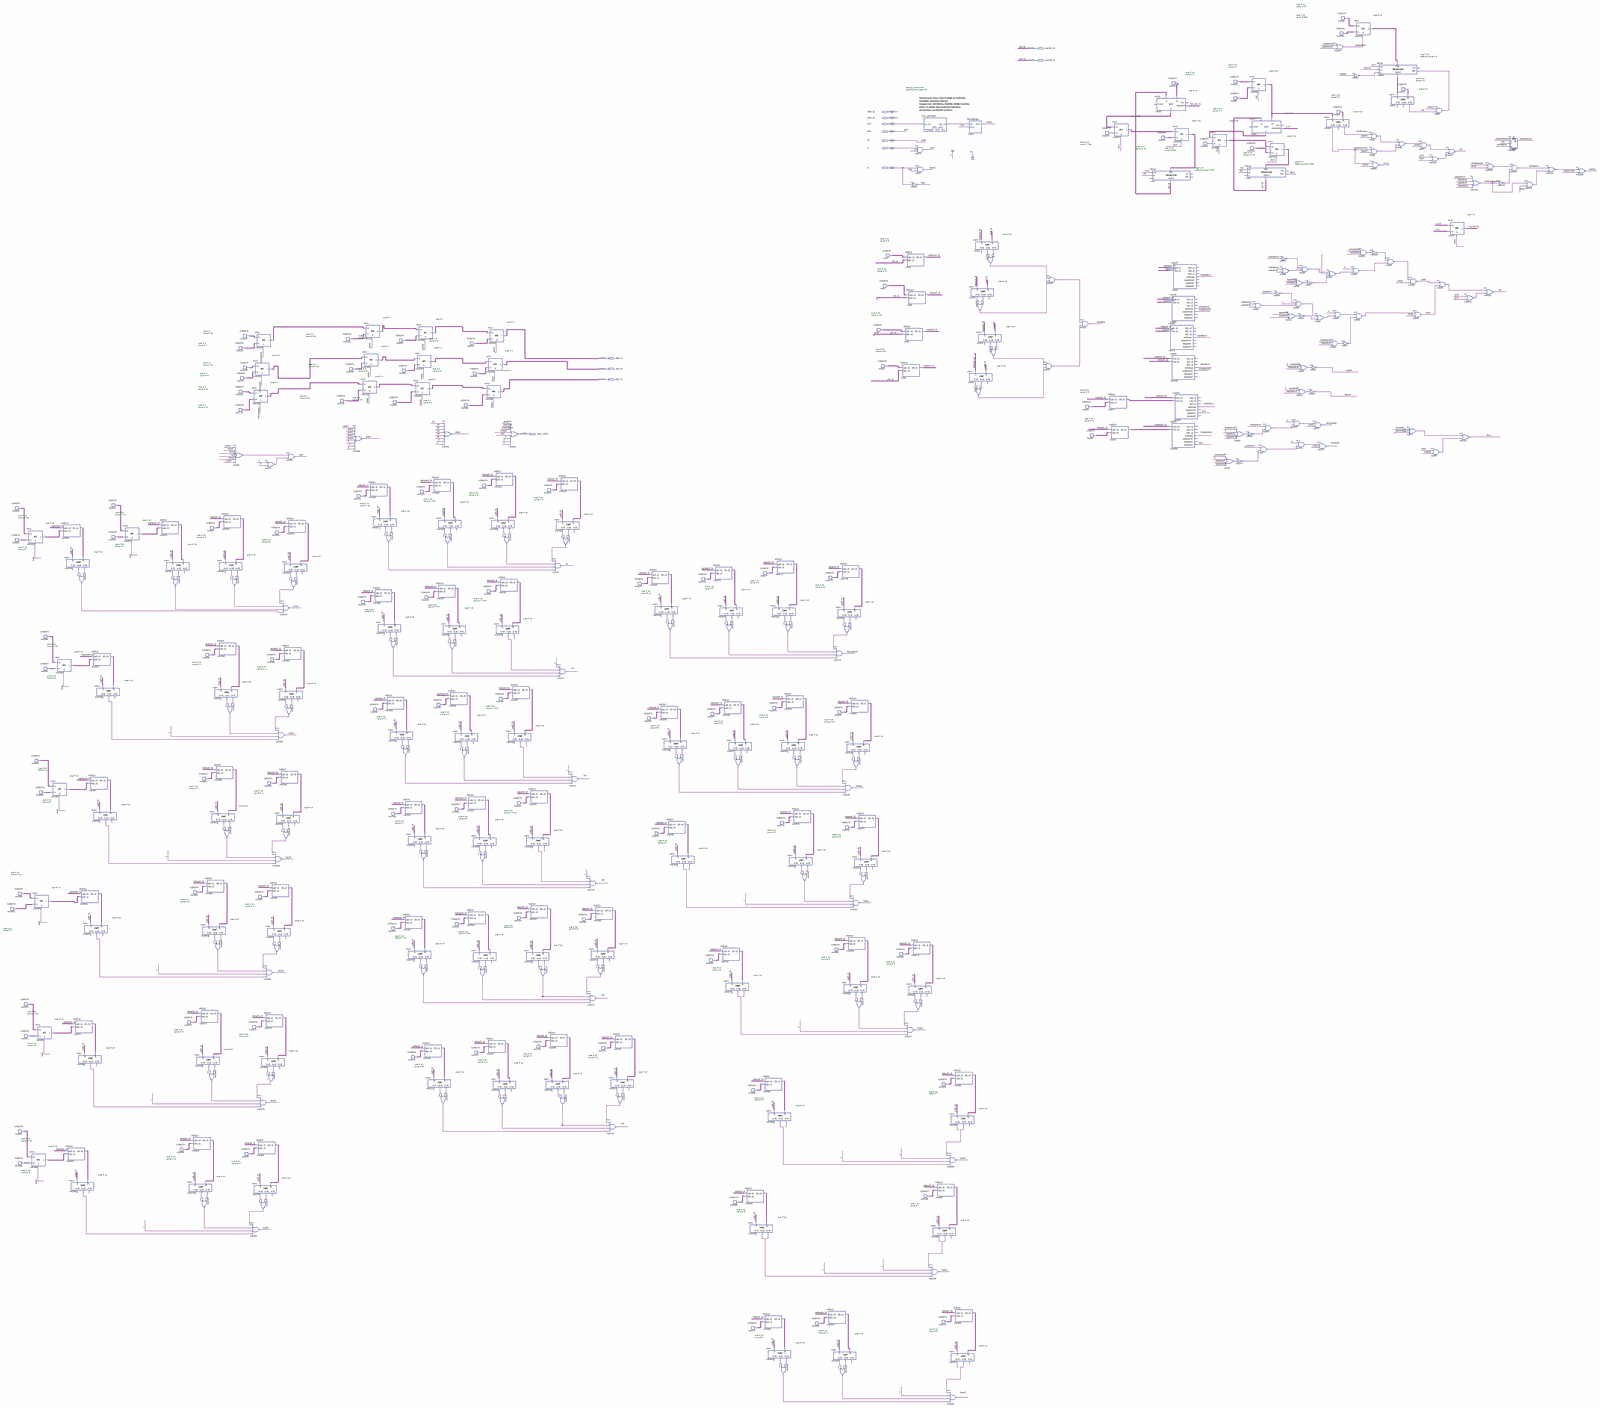
[diagram p0: schematic sheet, whole]
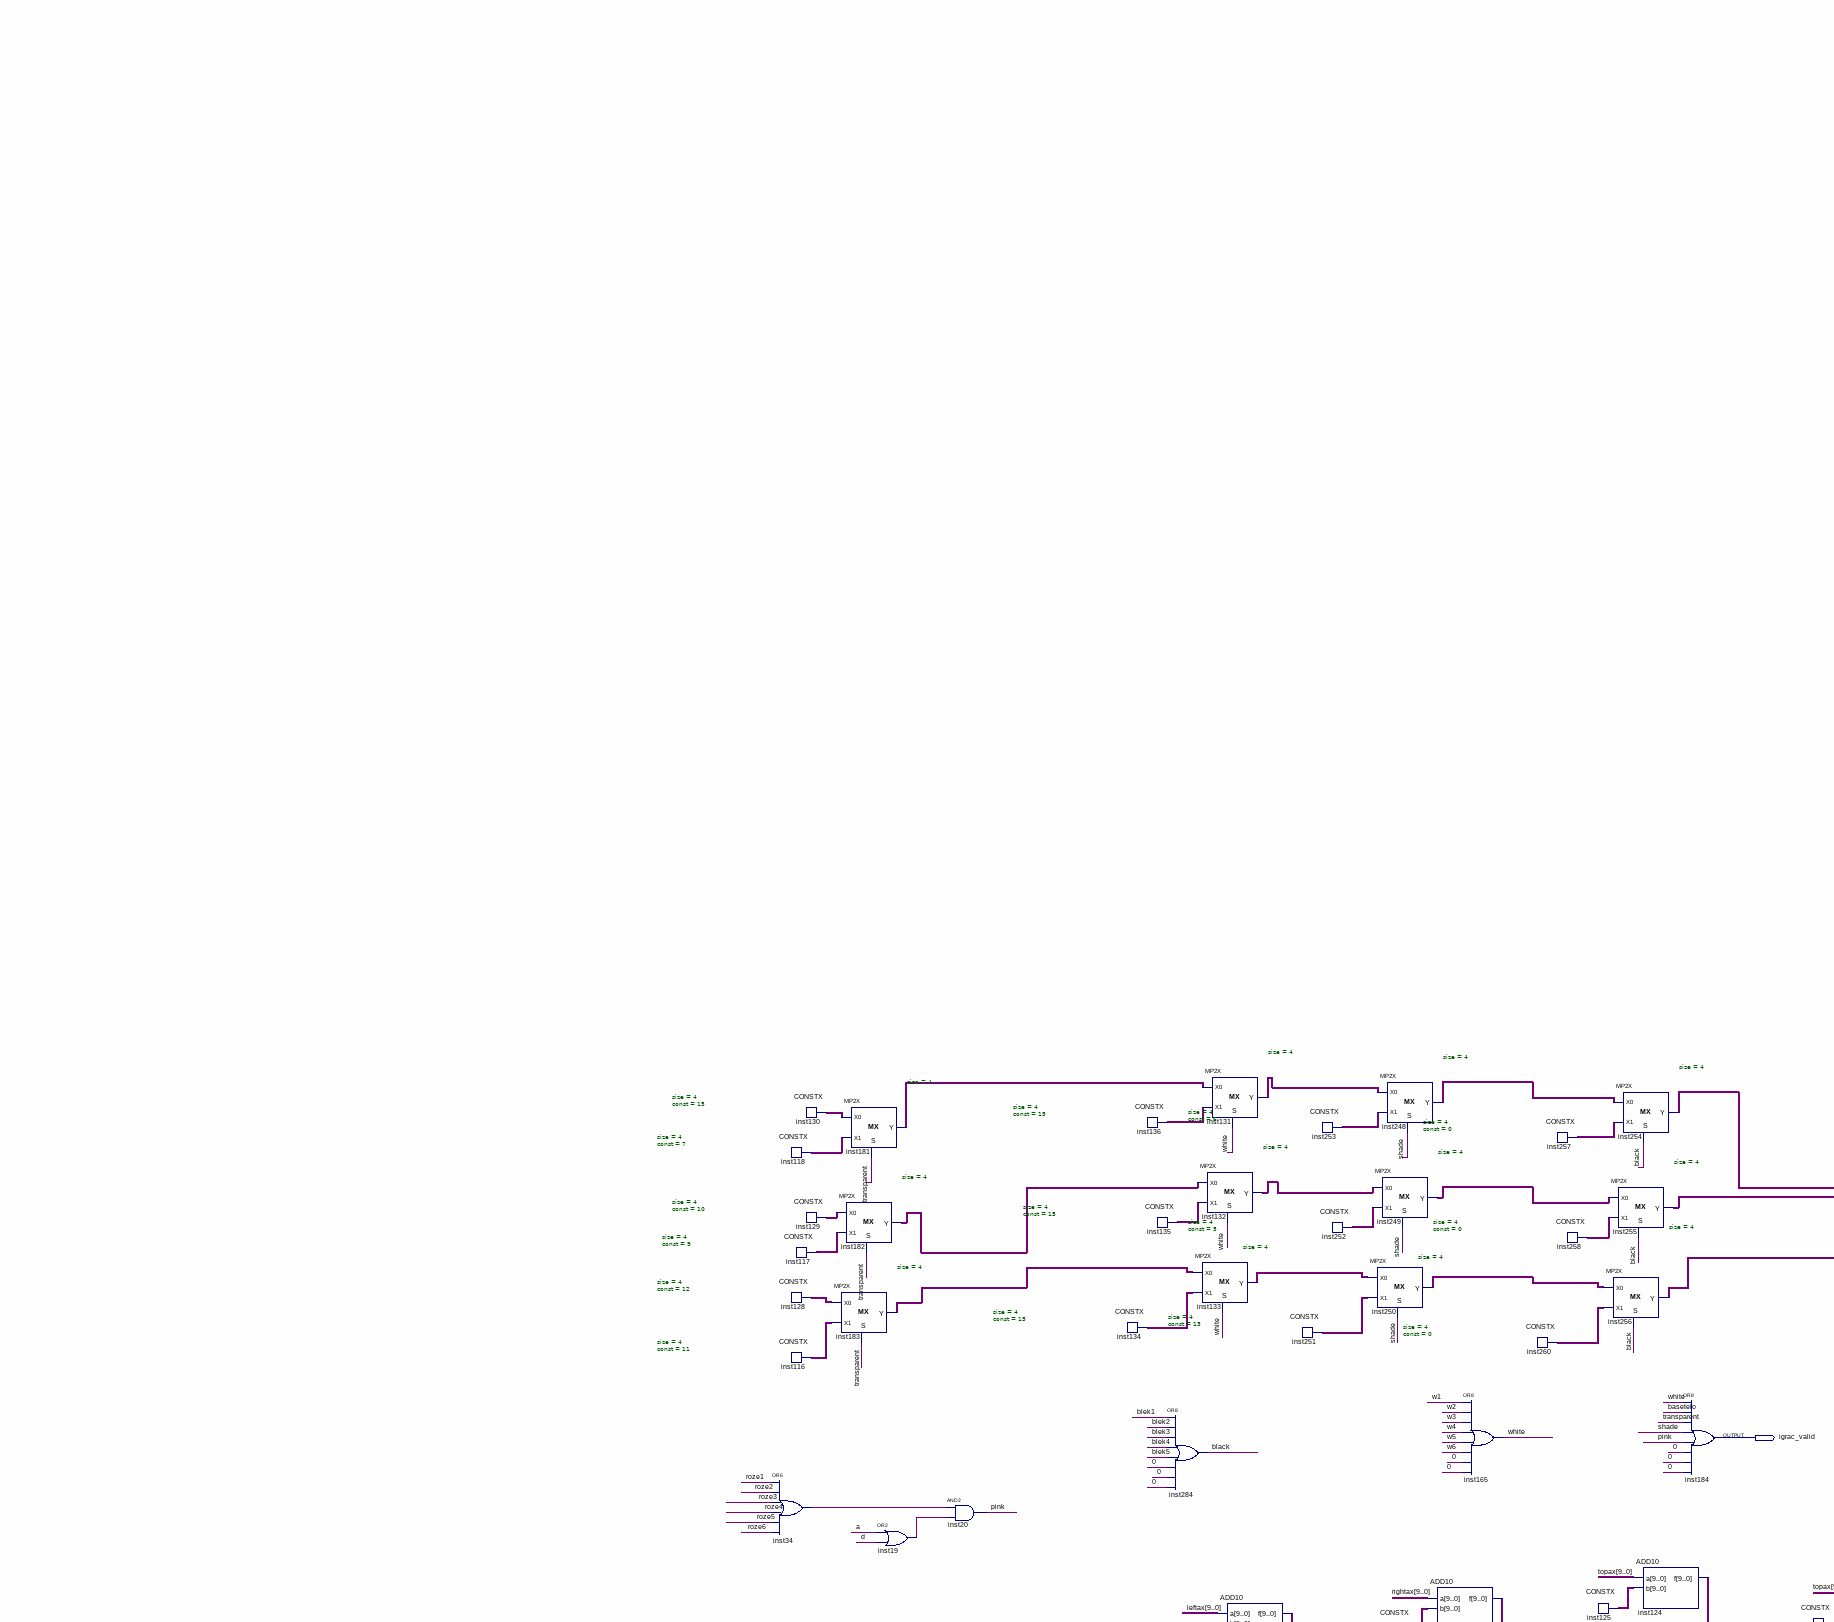
[diagram p1: schematic sheet, upper left part]
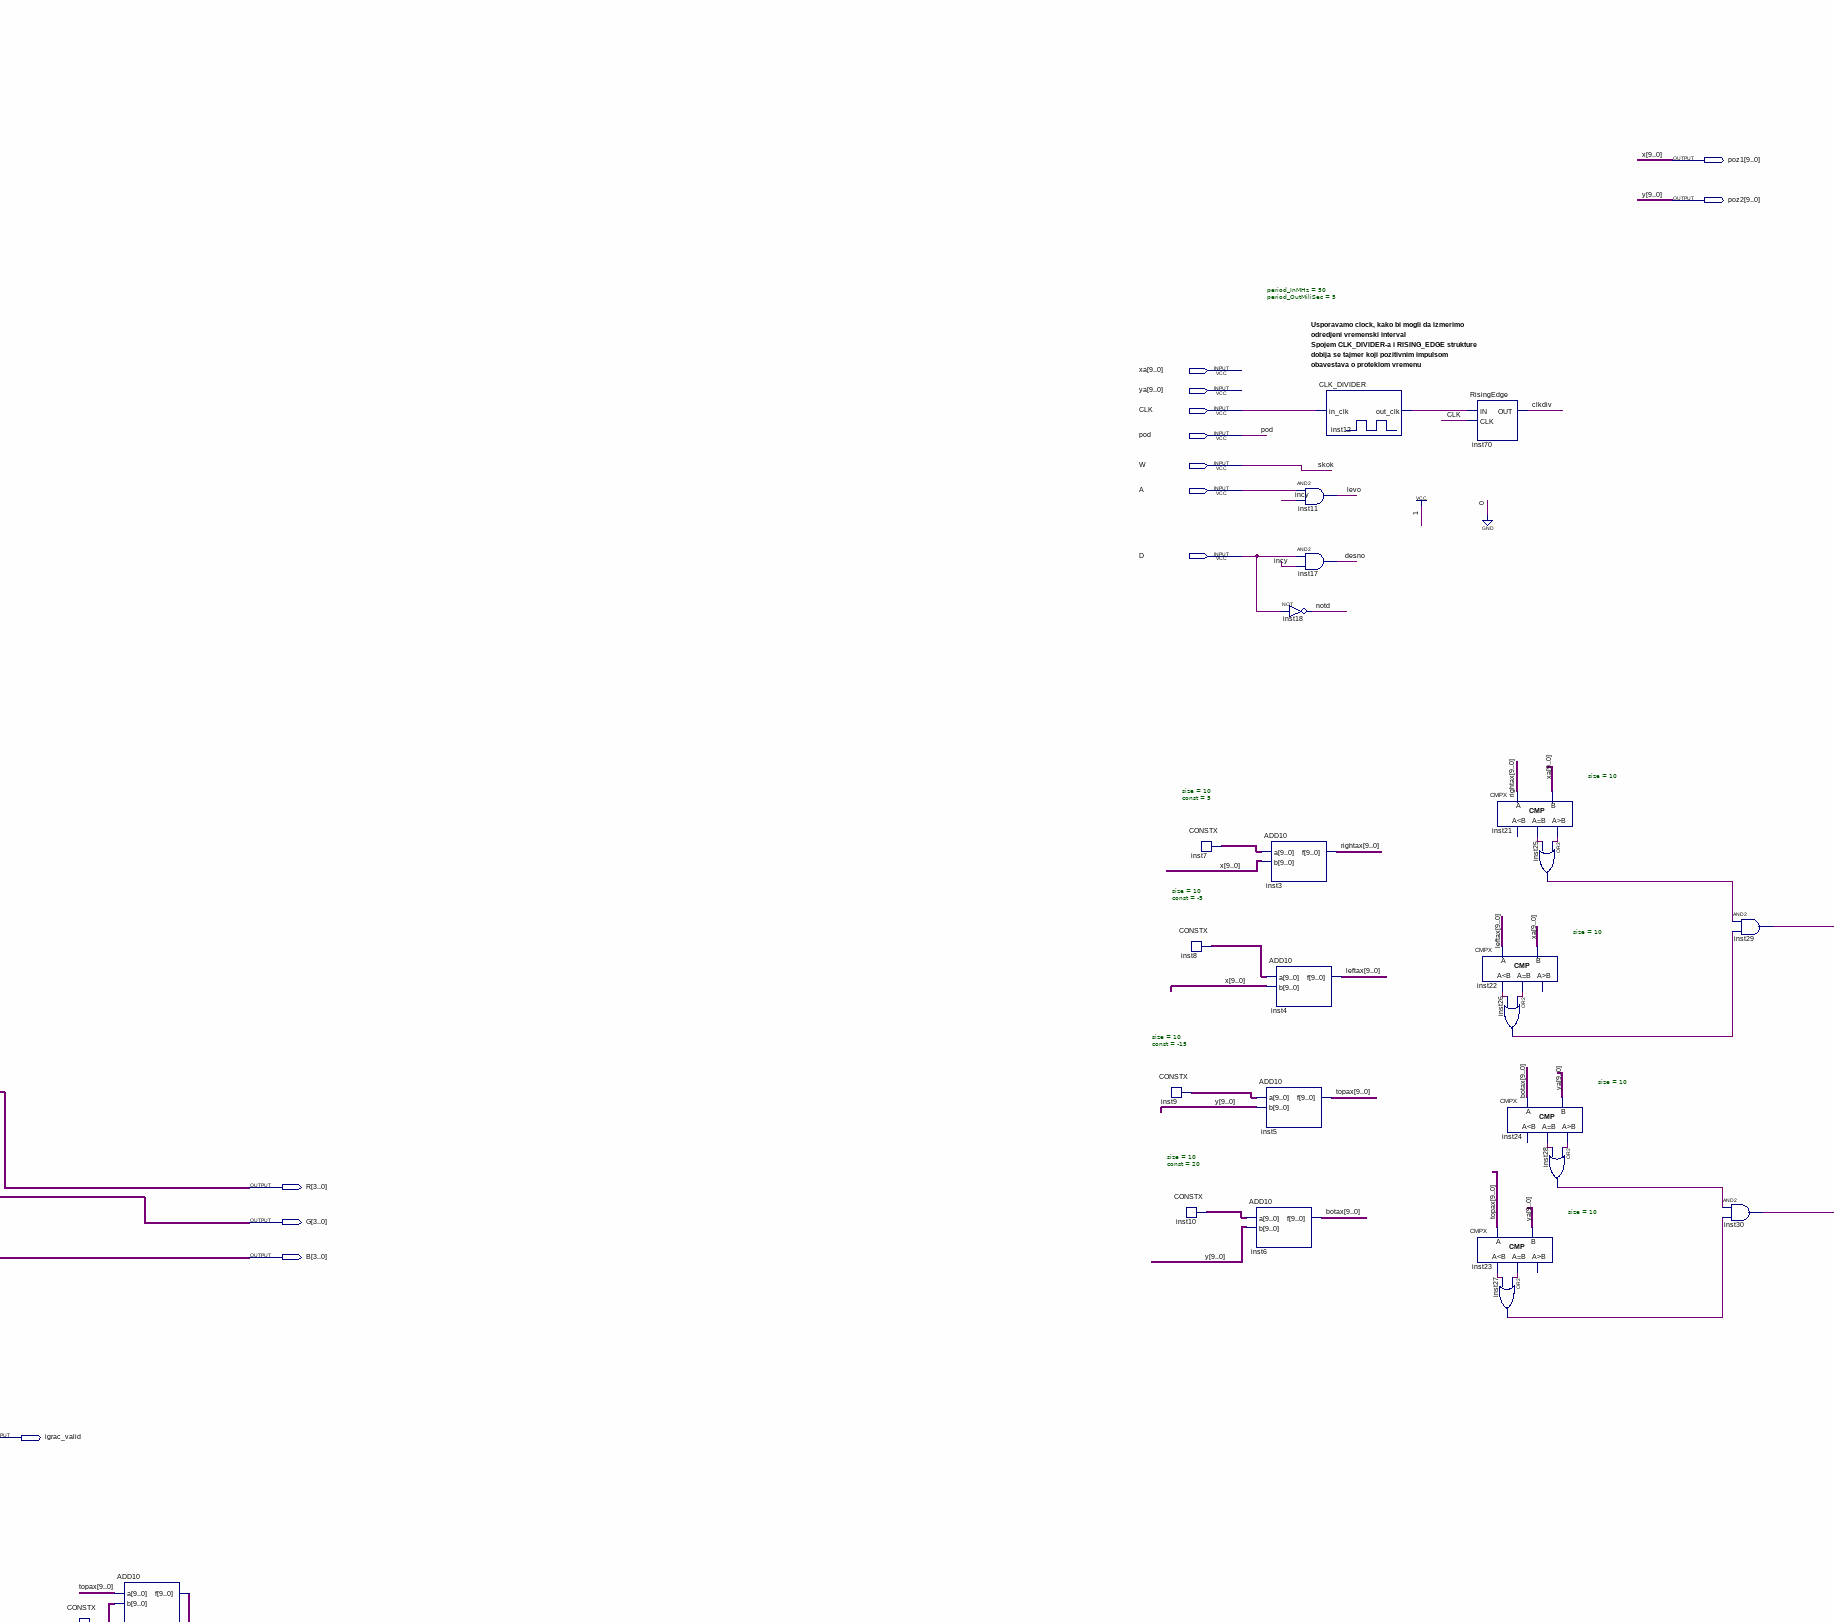
[diagram p2: schematic sheet, upper centre part]
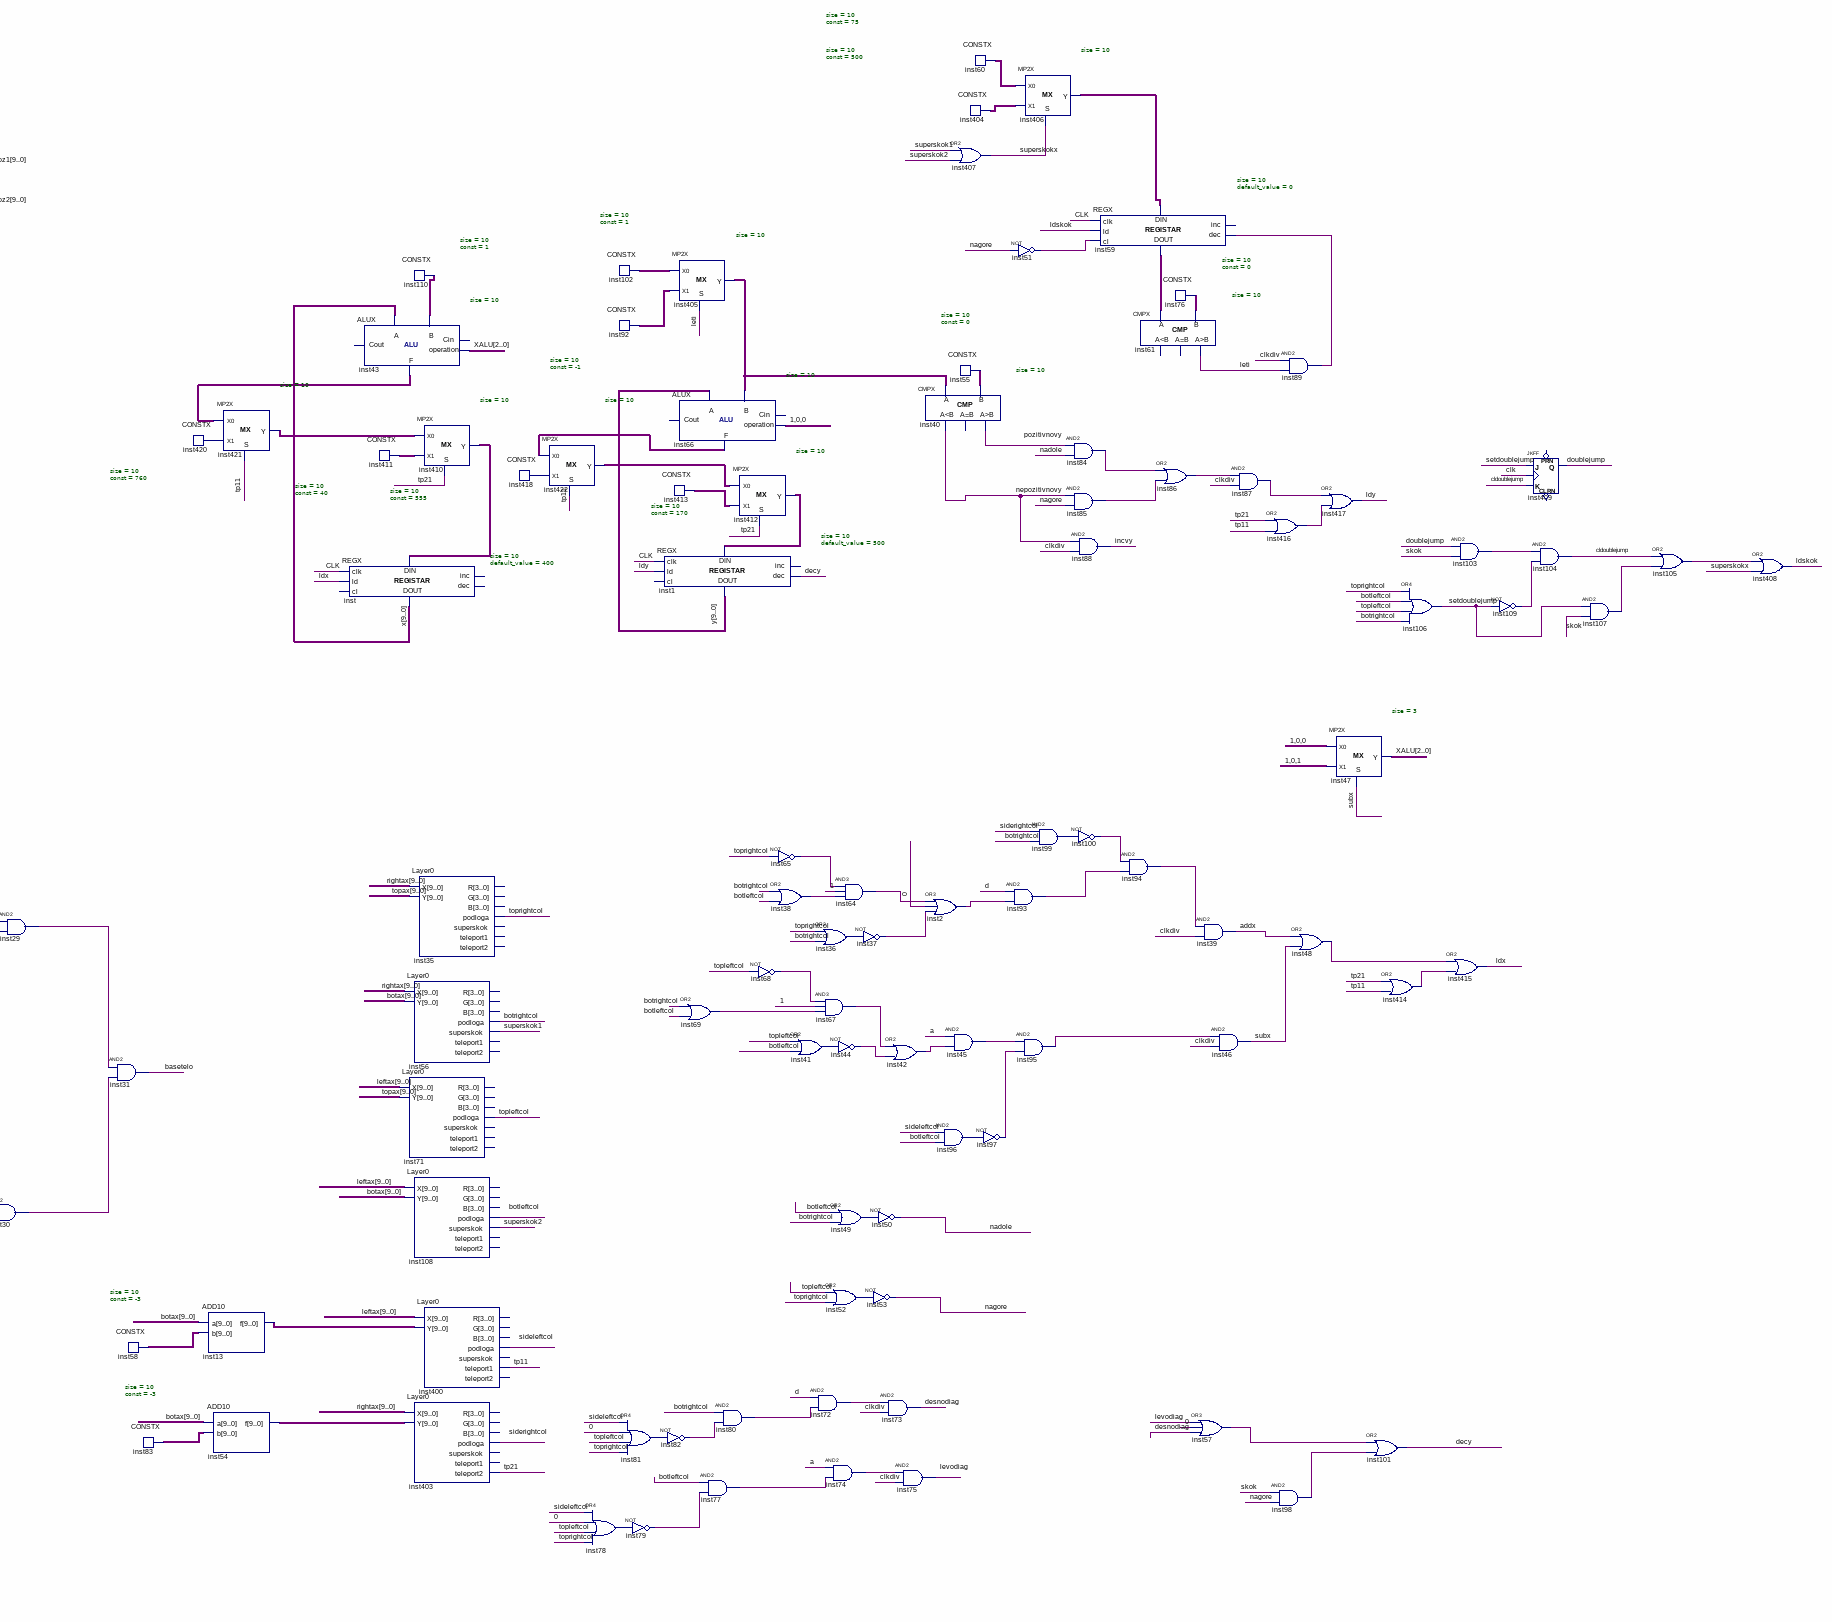
[diagram p3: schematic sheet, upper right part]
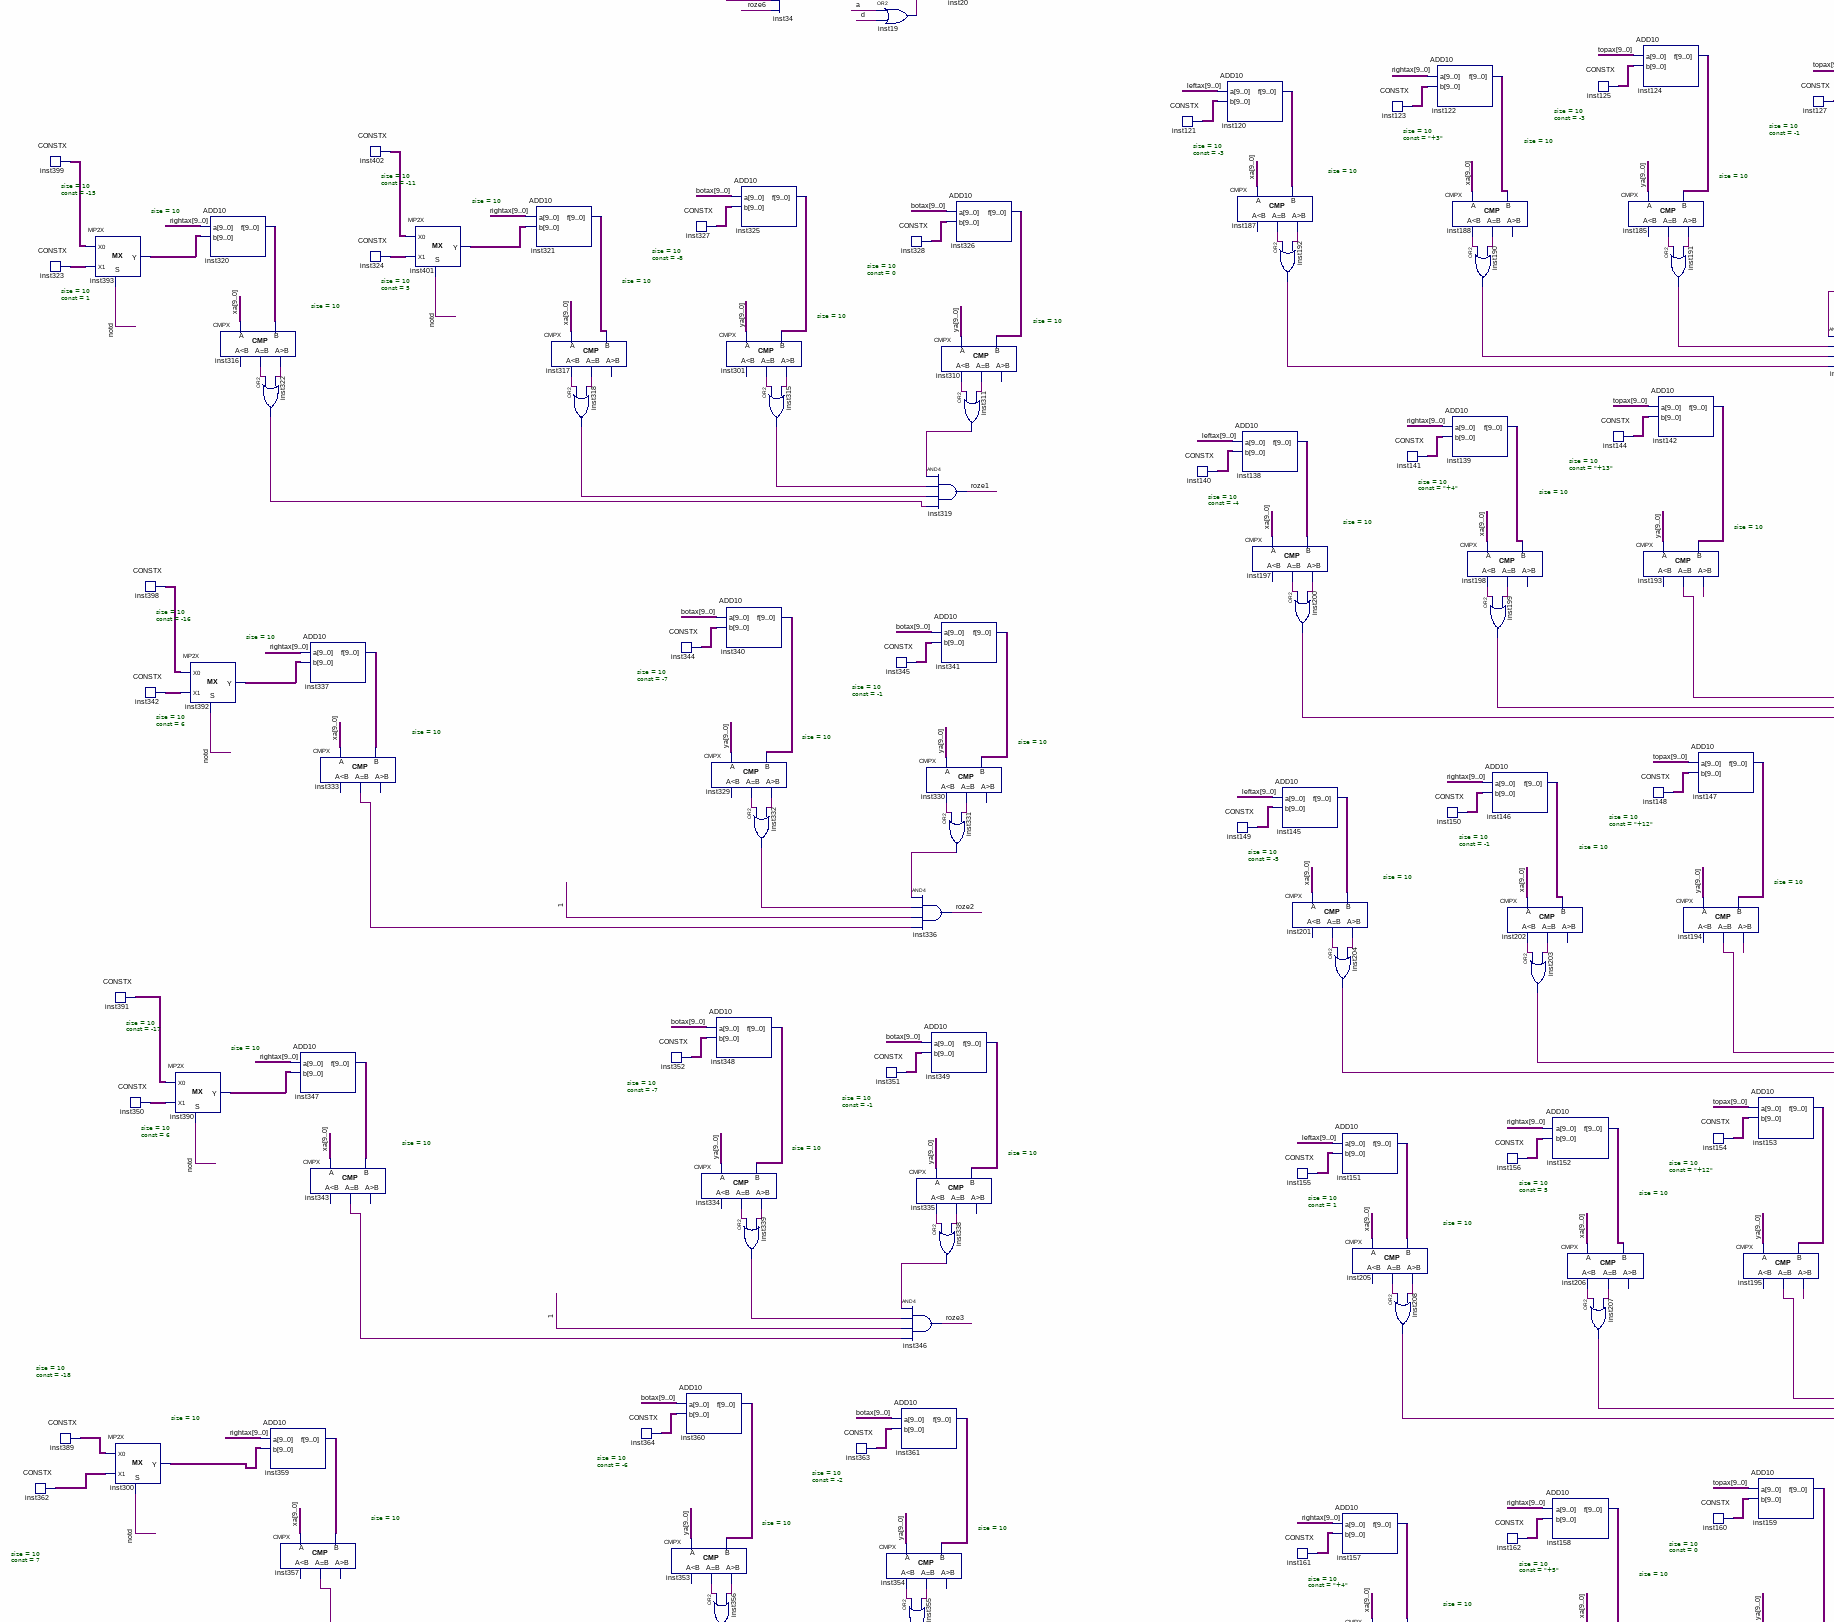
[diagram p4: schematic sheet, middle left part]
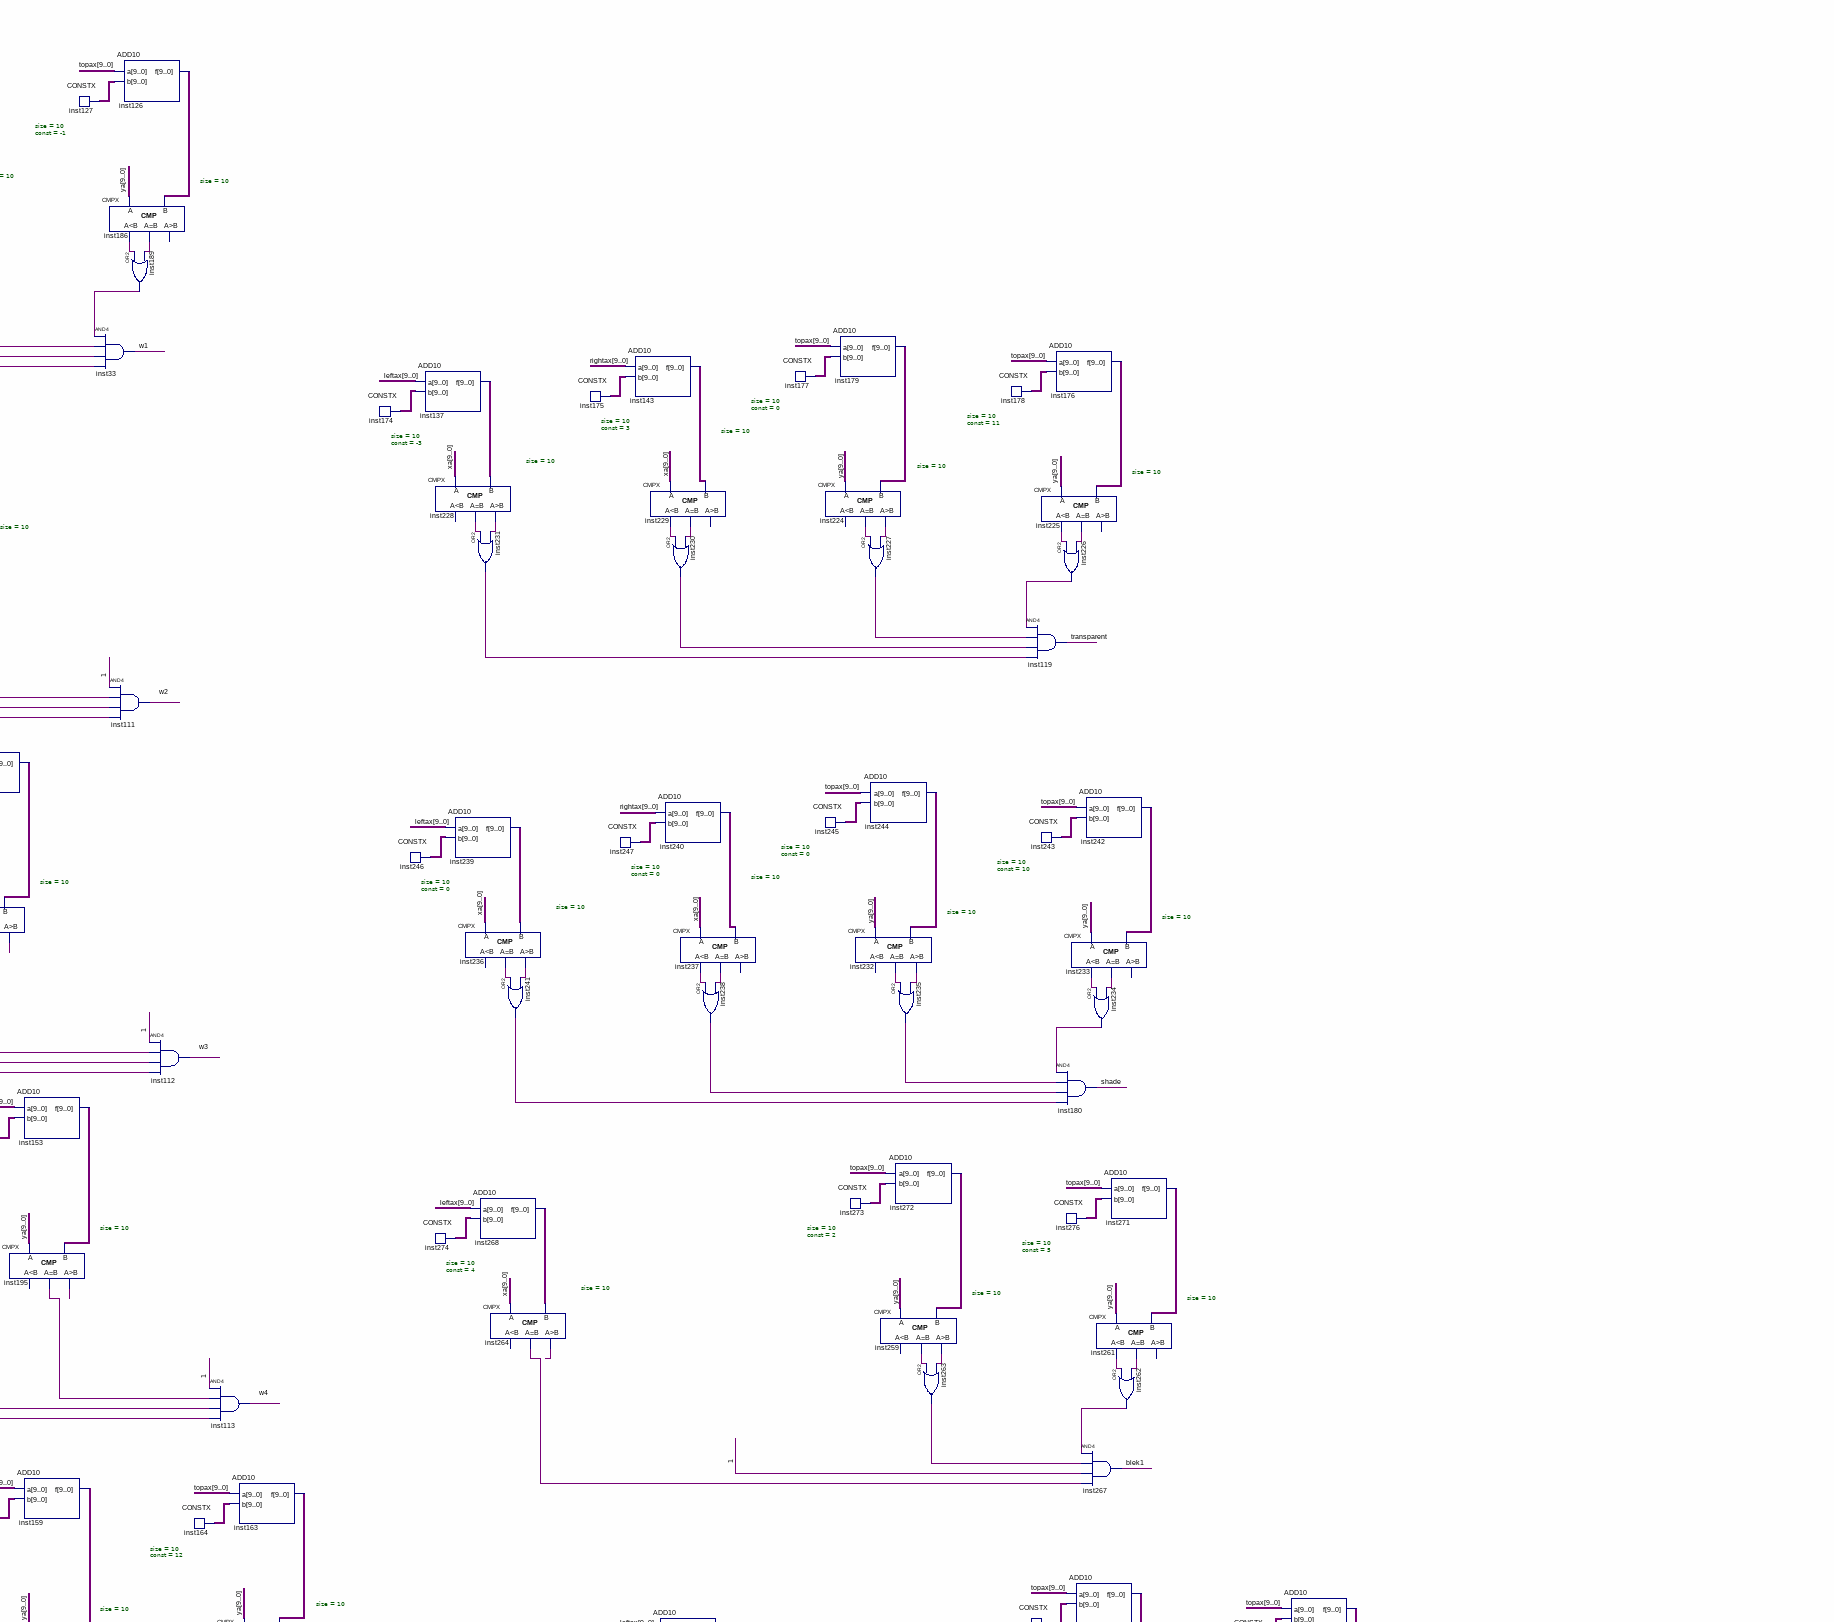
[diagram p5: schematic sheet, middle centre part]
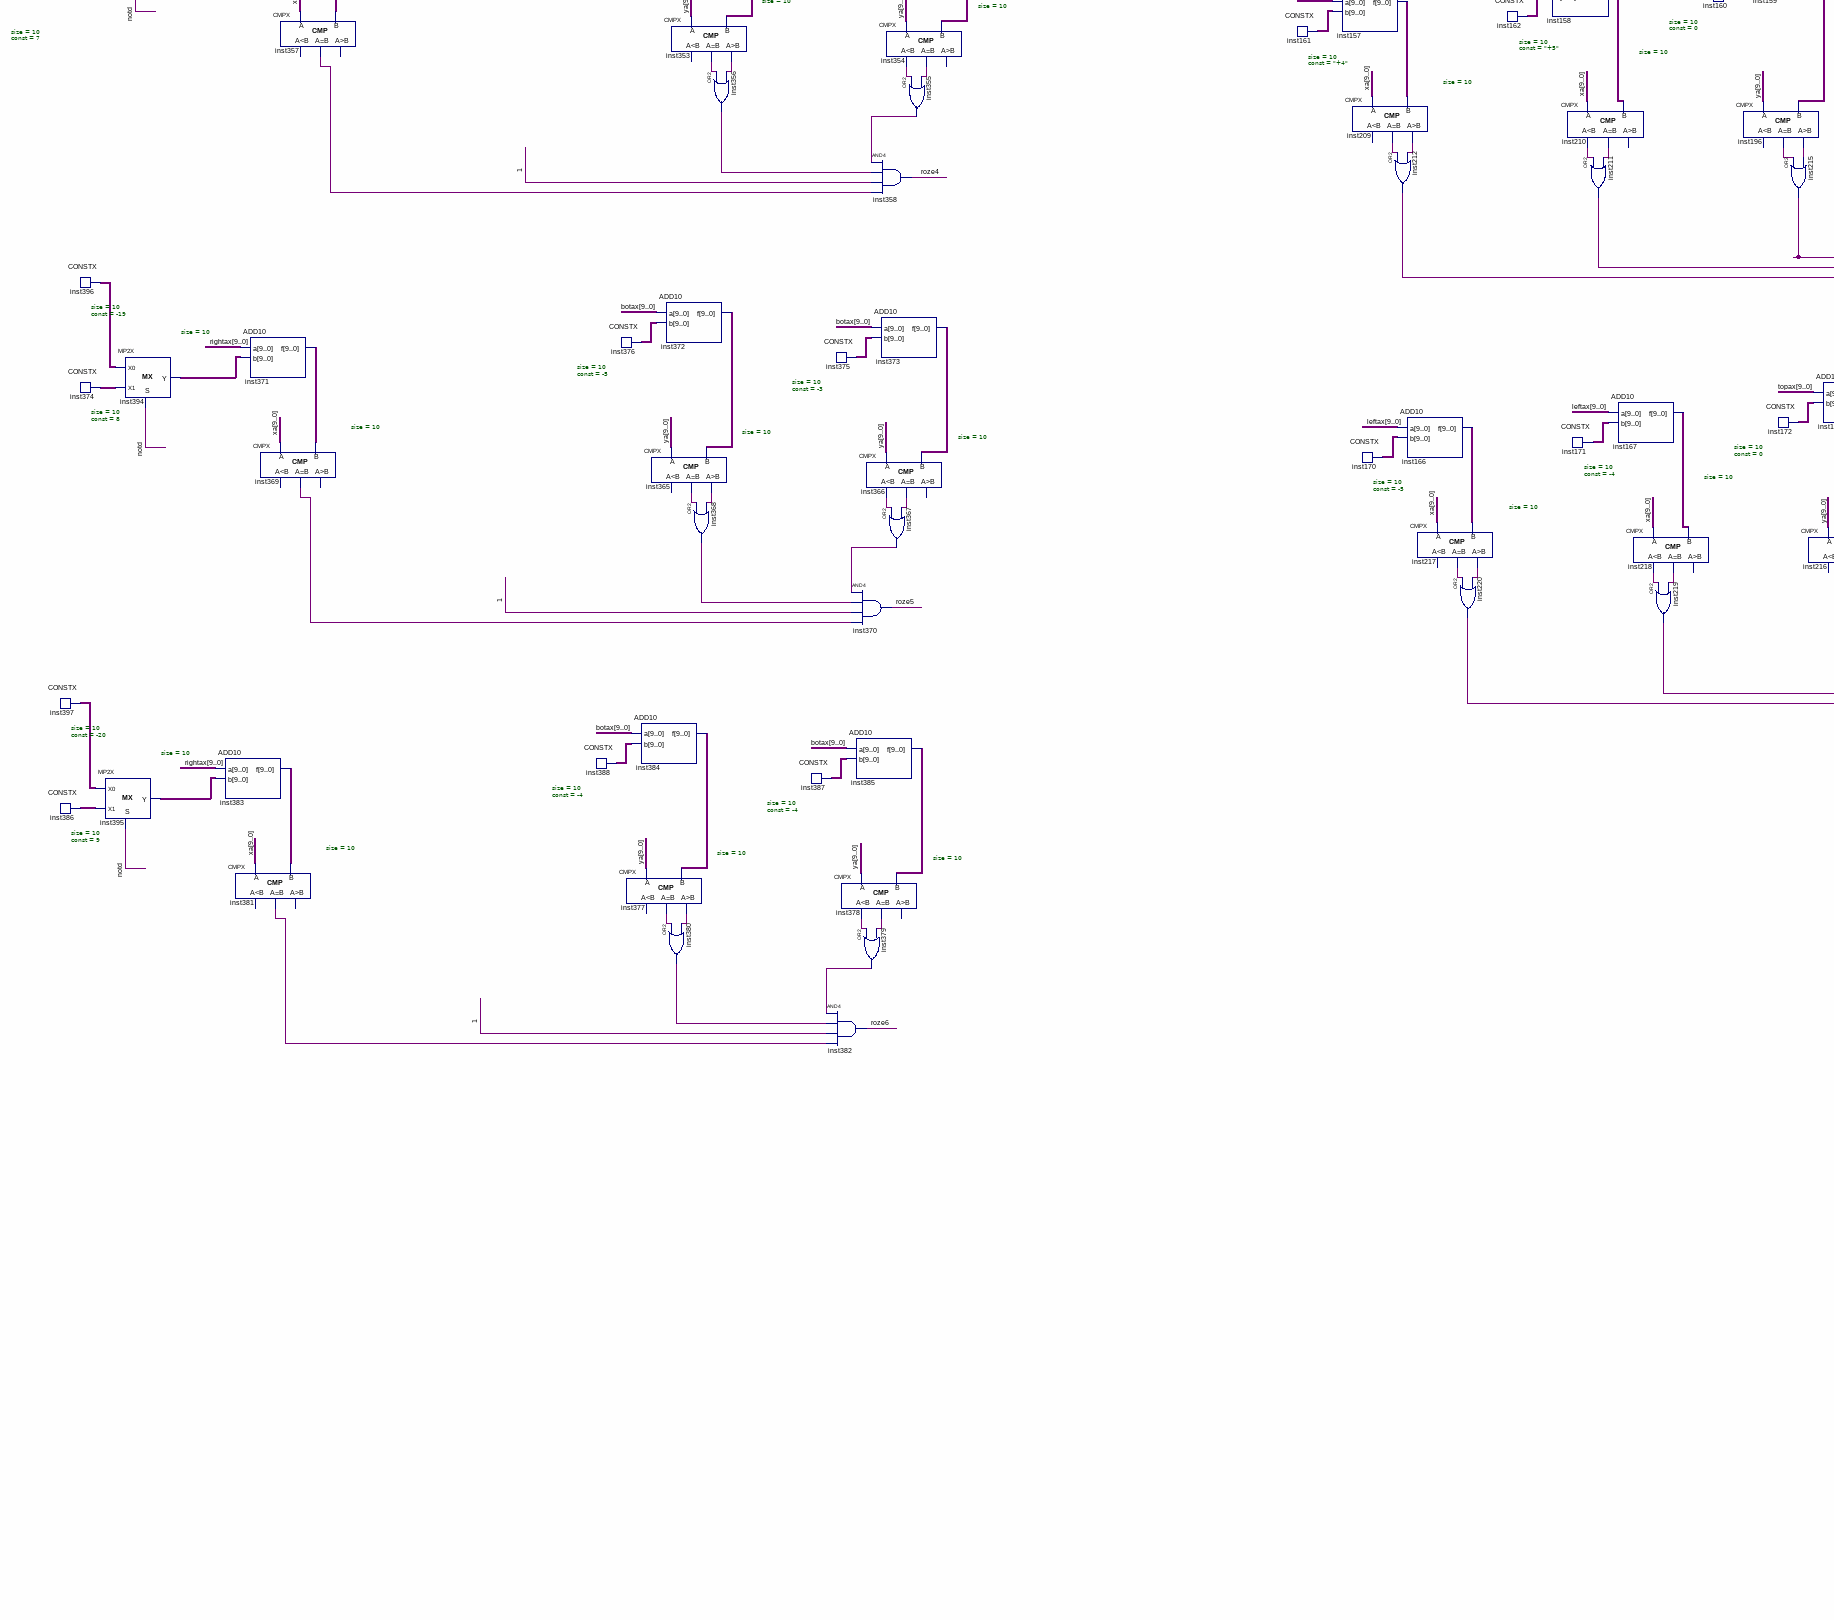
[diagram p6: schematic sheet, lower left part]
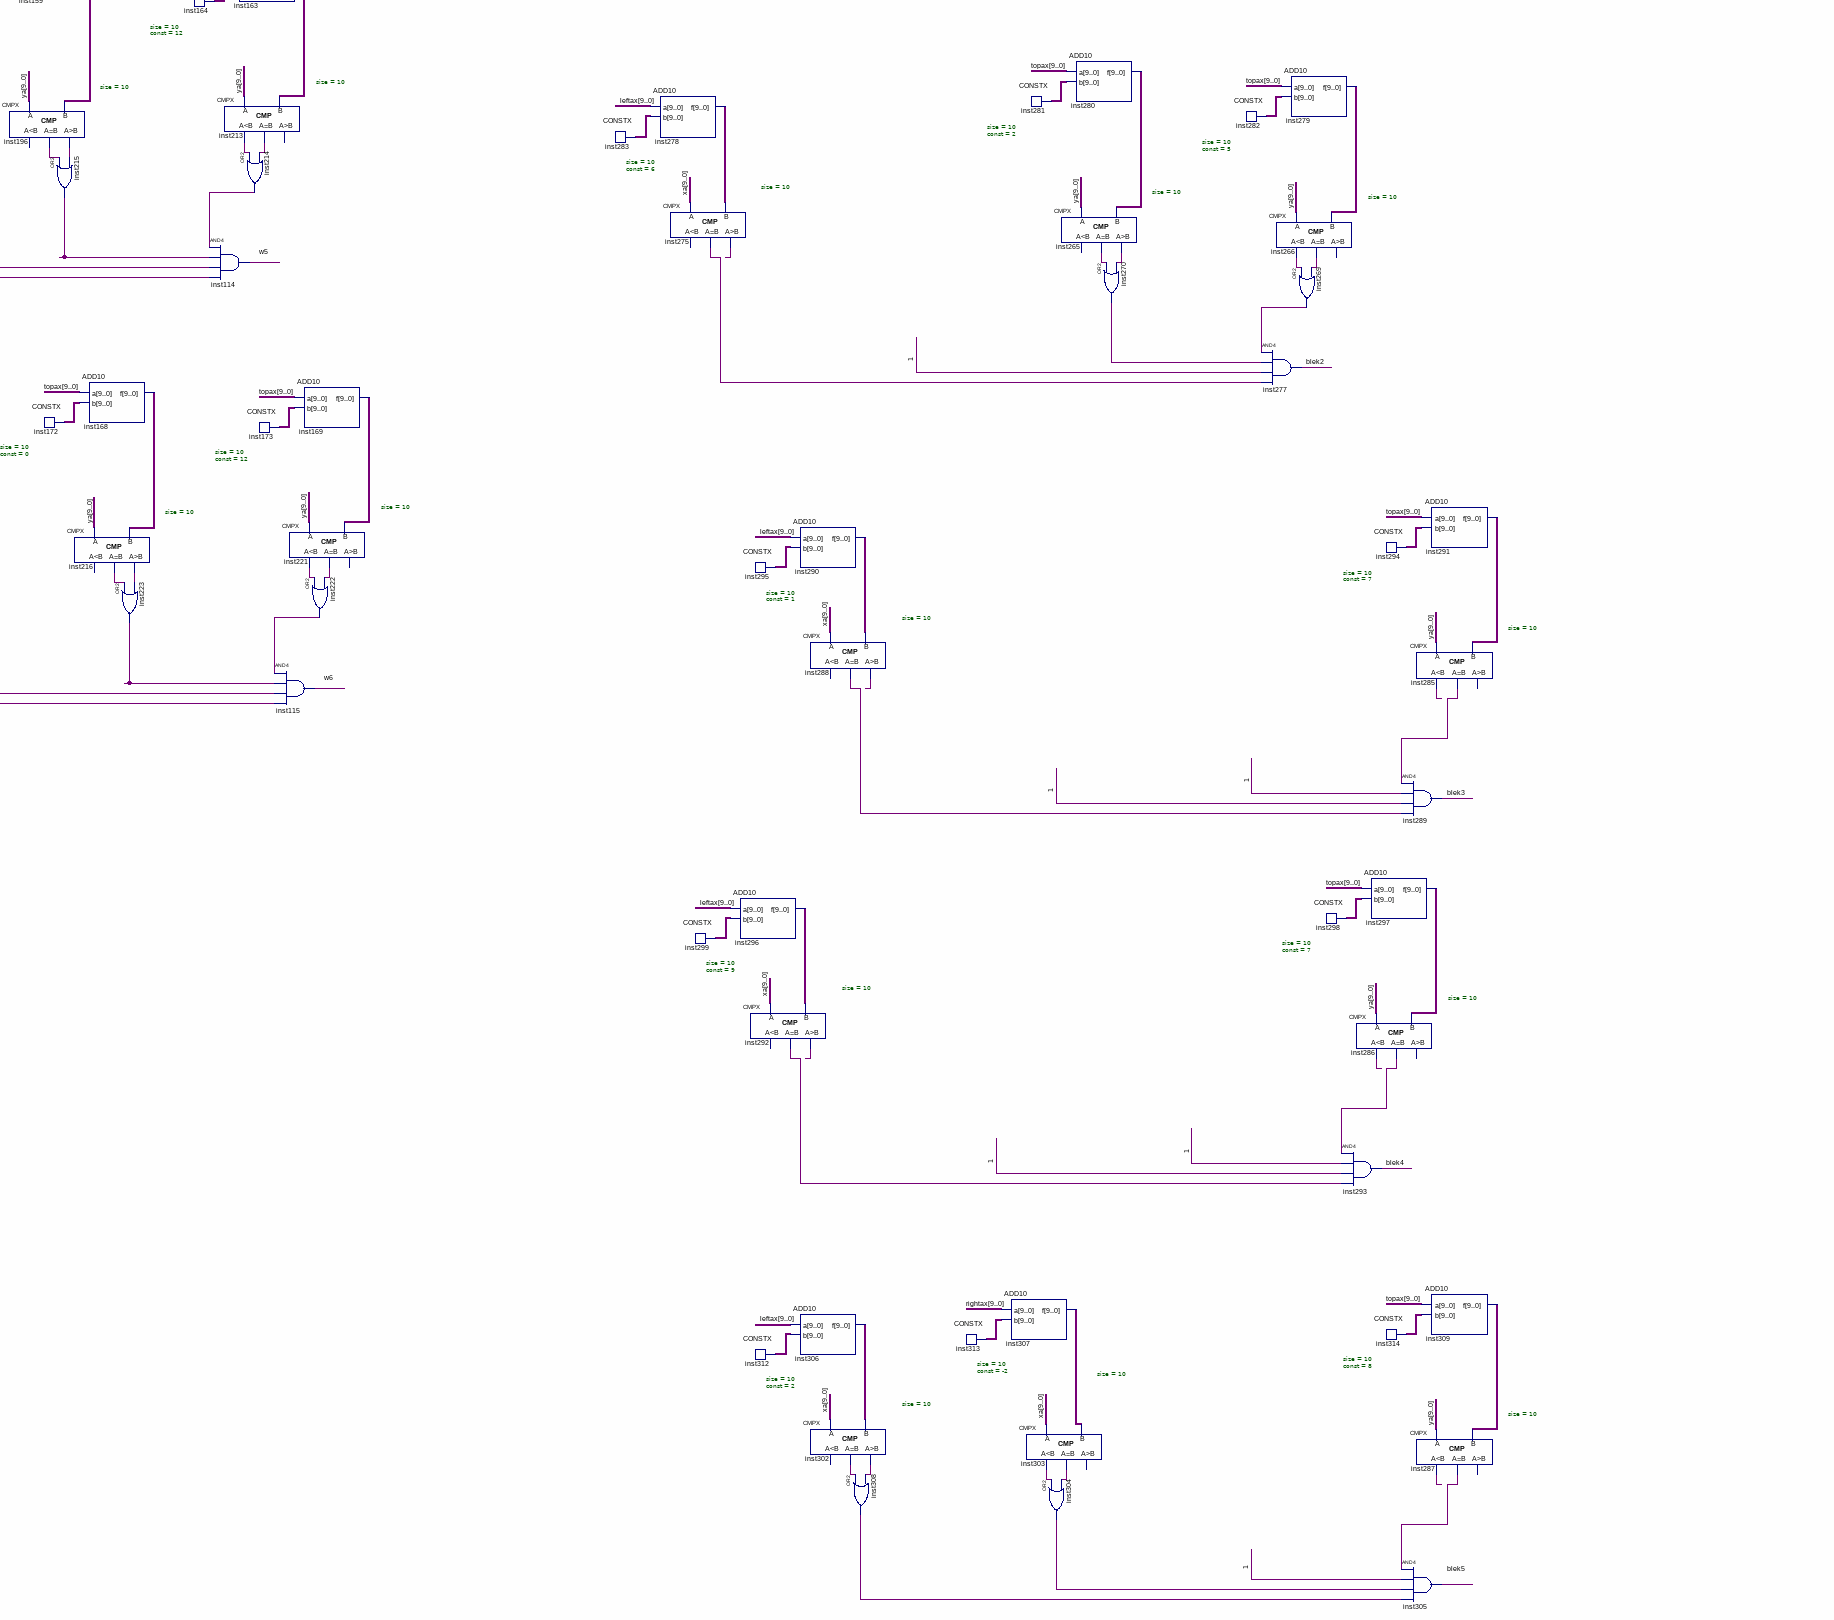
[diagram p7: schematic sheet, lower centre part]
// Quartus schematic IgracC.bdf as structural Verilog: 414 symbols, 13 pins
module IgracC (
  input  [9:0] xa,
  input  [9:0] ya,
  input  CLK,
  input  pod,
  input  W,
  input  A,
  input  D,
  output [9:0] poz1,
  output [9:0] poz2,
  output [3:0] R,
  output [3:0] G,
  output [3:0] B,
  output igrac_valid
);

  wire addx, basetelo, black, blek1, blek2, blek3, blek4, blek5, botleftcol, botrightcol, cldoublejump,
       clkdiv, decy, desno, desnodiag, doublejump, incvy, incy, inst2_out, inst12_out_clk, inst19_out,
       inst21_eq, inst21_gr, inst22_eq, inst22_ls, inst23_eq, inst23_ls, inst24_eq, inst24_gr, inst25_out,
       inst26_out, inst27_out, inst28_out, inst29_out, inst30_out, inst34_out, inst36_out, inst37_out,
       inst38_out, inst41_out, inst42_out, inst44_out, inst45_out, inst48_out, inst49_out, inst51_out,
       inst52_out, inst57_out, inst64_out, inst65_out, inst67_out, inst68_out, inst69_out, inst72_out,
       inst74_out, inst77_out, inst78_out, inst79_out, inst80_out, inst81_out, inst82_out, inst84_out,
       inst85_out, inst86_out, inst87_out, inst89_out, inst93_out, inst94_out, inst95_out, inst96_out,
       inst97_out, inst98_out, inst99_out, inst100_out, inst103_out, inst105_out, inst107_out, inst109_out,
       inst185_eq, inst185_gr, inst186_eq, inst186_ls, inst187_eq, inst187_gr, inst188_eq, inst188_ls,
       inst189_out, inst190_out, inst191_out, inst192_out, inst193_eq, inst193_gr, inst194_eq, inst194_gr,
       inst195_eq, inst195_gr, inst196_eq, inst196_gr, inst197_eq, inst197_gr, inst198_eq, inst198_ls,
       inst199_out, inst200_out, inst201_eq, inst201_gr, inst202_eq, inst202_ls, inst203_out, inst204_out,
       inst205_eq, inst205_gr, inst206_eq, inst206_ls, inst207_out, inst208_out, inst209_eq, inst209_gr,
       inst210_eq, inst210_ls, inst211_out, inst212_out, inst213_eq, inst213_ls, inst214_out, inst215_out,
       inst216_eq, inst216_gr, inst217_eq, inst217_gr, inst218_eq, inst218_ls, inst219_out, inst220_out,
       inst221_eq, inst221_ls, inst222_out, inst223_out, inst224_eq, inst224_gr, inst225_eq, inst225_ls,
       inst226_out, inst227_out, inst228_eq, inst228_gr, inst229_eq, inst229_ls, inst230_out, inst231_out,
       inst232_eq, inst232_gr, inst233_eq, inst233_ls, inst234_out, inst235_out, inst236_eq, inst236_gr,
       inst237_eq, inst237_ls, inst238_out, inst241_out, inst259_eq, inst259_gr, inst261_eq, inst261_ls,
       inst262_out, inst263_out, inst264_eq, inst264_gr, inst265_eq, inst265_gr, inst266_eq, inst266_ls,
       inst269_out, inst270_out, inst275_eq, inst275_gr, inst285_eq, inst285_ls, inst286_eq, inst286_ls,
       inst287_eq, inst287_ls, inst288_eq, inst288_gr, inst292_eq, inst292_gr, inst301_eq, inst301_gr,
       inst302_eq, inst302_gr, inst303_eq, inst303_ls, inst304_out, inst308_out, inst310_eq, inst310_ls,
       inst311_out, inst315_out, inst316_eq, inst316_gr, inst317_eq, inst317_ls, inst318_out, inst322_out,
       inst329_eq, inst329_gr, inst330_eq, inst330_ls, inst331_out, inst332_out, inst333_eq, inst334_eq,
       inst334_gr, inst335_eq, inst335_ls, inst338_out, inst339_out, inst343_eq, inst353_eq, inst353_gr,
       inst354_eq, inst354_ls, inst355_out, inst356_out, inst357_eq, inst365_eq, inst365_gr, inst366_eq,
       inst366_ls, inst367_out, inst368_out, inst369_eq, inst377_eq, inst377_gr, inst378_eq, inst378_ls,
       inst379_out, inst380_out, inst381_eq, inst414_out, inst416_out, ldskok, ldx, ldy, leti, levo,
       levodiag, nadole, nagore, nepozitivnovy, notd, pink, pozitivnovy, roze1, roze2, roze3, roze4, roze5,
       roze6, setdoublejump, shade, sideleftcol, siderightcol, subx, superskok1, superskok2, superskokx,
       topleftcol, toprightcol, tp11, tp21, transparent, w1, w2, w3, w4, w5, w6, white;
  wire [2:0] XALU;
  wire [3:0] inst116_data, inst117_data, inst118_data, inst128_data, inst129_data, inst130_data, inst131_y,
       inst132_y, inst133_y, inst134_data, inst135_data, inst136_data, inst181_y, inst182_y, inst183_y,
       inst248_y, inst249_y, inst250_y, inst251_data, inst252_data, inst253_data, inst257_data, inst258_data,
       inst260_data;
  wire [9:0] botax, inst7_data, inst8_data, inst9_data, inst10_data, inst13_f, inst43_f, inst54_f,
       inst55_data, inst58_data, inst59_data_out, inst60_data, inst66_f, inst76_data, inst83_data,
       inst92_data, inst102_data, inst110_data, inst120_f, inst121_data, inst122_f, inst123_data, inst124_f,
       inst125_data, inst126_f, inst127_data, inst137_f, inst138_f, inst139_f, inst140_data, inst141_data,
       inst142_f, inst143_f, inst144_data, inst145_f, inst146_f, inst147_f, inst148_data, inst149_data,
       inst150_data, inst151_f, inst152_f, inst153_f, inst154_data, inst155_data, inst156_data, inst157_f,
       inst158_f, inst159_f, inst160_data, inst161_data, inst162_data, inst163_f, inst164_data, inst166_f,
       inst167_f, inst168_f, inst169_f, inst170_data, inst171_data, inst172_data, inst173_data, inst174_data,
       inst175_data, inst176_f, inst177_data, inst178_data, inst179_f, inst239_f, inst240_f, inst242_f,
       inst243_data, inst244_f, inst245_data, inst246_data, inst247_data, inst268_f, inst271_f, inst272_f,
       inst273_data, inst274_data, inst276_data, inst278_f, inst279_f, inst280_f, inst281_data, inst282_data,
       inst283_data, inst290_f, inst291_f, inst294_data, inst295_data, inst296_f, inst297_f, inst298_data,
       inst299_data, inst300_y, inst306_f, inst307_f, inst309_f, inst312_data, inst313_data, inst314_data,
       inst320_f, inst321_f, inst323_data, inst324_data, inst325_f, inst326_f, inst327_data, inst328_data,
       inst337_f, inst340_f, inst341_f, inst342_data, inst344_data, inst345_data, inst347_f, inst348_f,
       inst349_f, inst350_data, inst351_data, inst352_data, inst359_f, inst360_f, inst361_f, inst362_data,
       inst363_data, inst364_data, inst371_f, inst372_f, inst373_f, inst374_data, inst375_data, inst376_data,
       inst383_f, inst384_f, inst385_f, inst386_data, inst387_data, inst388_data, inst389_data, inst390_y,
       inst391_data, inst392_y, inst393_y, inst394_y, inst395_y, inst396_data, inst397_data, inst398_data,
       inst399_data, inst401_y, inst402_data, inst404_data, inst405_y, inst406_y, inst410_y, inst411_data,
       inst412_y, inst413_data, inst418_data, inst420_data, inst421_y, inst422_y, leftax, rightax, topax;

  CONSTX #(.size(10), .\const (7)) inst362 (.data(inst362_data));
  CONSTX #(.size(10), .\const (-15)) inst399 (.data(inst399_data));
  CONSTX #(.size(10), .\const (1)) inst323 (.data(inst323_data));
  CONSTX #(.size(10), .\const (-18)) inst389 (.data(inst389_data));
  CONSTX #(.size(10), .\const (-20)) inst397 (.data(inst397_data));
  CONSTX #(.size(10), .\const (9)) inst386 (.data(inst386_data));
  MP2X #(.size(10)) inst393 (.S(notd), .X0(inst399_data), .X1(inst323_data), .Y(inst393_y));
  CONSTX #(.size(10), .\const (-17)) inst391 (.data(inst391_data));
  CONSTX #(.size(10), .\const (-19)) inst396 (.data(inst396_data));
  CONSTX #(.size(10), .\const (8)) inst374 (.data(inst374_data));
  MP2X #(.size(10)) inst395 (.S(notd), .X0(inst397_data), .X1(inst386_data), .Y(inst395_y));
  CONSTX #(.size(10), .\const (-16)) inst398 (.data(inst398_data));
  CONSTX #(.size(10), .\const (6)) inst342 (.data(inst342_data));
  CONSTX #(.size(10), .\const (6)) inst350 (.data(inst350_data));
  MP2X #(.size(10)) inst300 (.S(notd), .X0(inst389_data), .X1(inst362_data), .Y(inst300_y));
  MP2X #(.size(10)) inst394 (.S(notd), .X0(inst396_data), .X1(inst374_data), .Y(inst394_y));
  MP2X #(.size(10)) inst392 (.S(notd), .X0(inst398_data), .X1(inst342_data), .Y(inst392_y));
  MP2X #(.size(10)) inst390 (.S(notd), .X0(inst391_data), .X1(inst350_data), .Y(inst390_y));
  ADD10 inst320 (.a(rightax), .b(inst393_y), .f(inst320_f));
  CMPX #(.size(10)) inst316 (.A(xa), .B(inst320_f), .eq(inst316_eq), .gr(inst316_gr));  // open: ls
  ADD10 inst383 (.a(rightax), .b(inst395_y), .f(inst383_f));
  or inst322 (inst322_out, inst316_eq, inst316_gr);
  ADD10 inst359 (.a(rightax), .b(inst300_y), .f(inst359_f));
  ADD10 inst371 (.a(rightax), .b(inst394_y), .f(inst371_f));
  CMPX #(.size(10)) inst369 (.A(xa), .B(inst371_f), .eq(inst369_eq));  // open: ls, gr
  CMPX #(.size(10)) inst381 (.A(xa), .B(inst383_f), .eq(inst381_eq));  // open: ls, gr
  ADD10 inst337 (.a(rightax), .b(inst392_y), .f(inst337_f));
  ADD10 inst347 (.a(rightax), .b(inst390_y), .f(inst347_f));
  CMPX #(.size(10)) inst343 (.A(xa), .B(inst347_f), .eq(inst343_eq));  // open: ls, gr
  CMPX #(.size(10)) inst357 (.A(xa), .B(inst359_f), .eq(inst357_eq));  // open: ls, gr
  CMPX #(.size(10)) inst333 (.A(xa), .B(inst337_f), .eq(inst333_eq));  // open: ls, gr
  CONSTX #(.size(10), .\const (-11)) inst402 (.data(inst402_data));
  CONSTX #(.size(10), .\const (5)) inst324 (.data(inst324_data));
  MP2X #(.size(10)) inst401 (.S(notd), .X0(inst402_data), .X1(inst324_data), .Y(inst401_y));
  ADD10 inst321 (.a(rightax), .b(inst401_y), .f(inst321_f));
  CMPX #(.size(10)) inst317 (.A(xa), .B(inst321_f), .ls(inst317_ls), .eq(inst317_eq));  // open: gr
  or inst318 (inst318_out, inst317_ls, inst317_eq);
  CONSTX #(.size(10), .\const (-4)) inst388 (.data(inst388_data));
  CONSTX #(.size(10), .\const (-5)) inst376 (.data(inst376_data));
  CMPX #(.size(10)) inst377 (.A(ya), .B(inst384_f), .eq(inst377_eq), .gr(inst377_gr));  // open: ls
  CONSTX #(.size(10), .\const (-7)) inst352 (.data(inst352_data));
  CONSTX #(.size(10), .\const (-6)) inst364 (.data(inst364_data));
  CMPX #(.size(10)) inst353 (.A(ya), .B(inst360_f), .eq(inst353_eq), .gr(inst353_gr));  // open: ls
  ADD10 inst372 (.a(botax), .b(inst376_data), .f(inst372_f));
  CMPX #(.size(10)) inst365 (.A(ya), .B(inst372_f), .eq(inst365_eq), .gr(inst365_gr));  // open: ls
  ADD10 inst384 (.a(botax), .b(inst388_data), .f(inst384_f));
  or inst380 (inst380_out, inst377_eq, inst377_gr);
  CONSTX #(.size(10), .\const (-8)) inst327 (.data(inst327_data));
  CONSTX #(.size(10), .\const (-7)) inst344 (.data(inst344_data));
  CMPX #(.size(10)) inst329 (.A(ya), .B(inst340_f), .eq(inst329_eq), .gr(inst329_gr));  // open: ls
  CMPX #(.size(10)) inst334 (.A(ya), .B(inst348_f), .eq(inst334_eq), .gr(inst334_gr));  // open: ls
  ADD10 inst360 (.a(botax), .b(inst364_data), .f(inst360_f));
  or inst368 (inst368_out, inst365_eq, inst365_gr);
  ADD10 inst325 (.a(botax), .b(inst327_data), .f(inst325_f));
  CMPX #(.size(10)) inst301 (.A(ya), .B(inst325_f), .eq(inst301_eq), .gr(inst301_gr));  // open: ls
  ADD10 inst340 (.a(botax), .b(inst344_data), .f(inst340_f));
  ADD10 inst348 (.a(botax), .b(inst352_data), .f(inst348_f));
  or inst339 (inst339_out, inst334_eq, inst334_gr);
  or inst356 (inst356_out, inst353_eq, inst353_gr);
  CONSTX #(.size(4), .\const (7)) inst118 (.data(inst118_data));
  CONSTX #(.size(4), .\const (9)) inst117 (.data(inst117_data));
  CONSTX #(.size(4), .\const (12)) inst128 (.data(inst128_data));
  CONSTX #(.size(4), .\const (11)) inst116 (.data(inst116_data));
  or inst34 (inst34_out, roze1, roze2, roze3, roze4, roze5, roze6);
  or inst315 (inst315_out, inst301_eq, inst301_gr);
  or inst332 (inst332_out, inst329_eq, inst329_gr);
  CONSTX #(.size(4), .\const (15)) inst130 (.data(inst130_data));
  CONSTX #(.size(4), .\const (10)) inst129 (.data(inst129_data));
  CONSTX #(.size(10), .\const (-3)) inst375 (.data(inst375_data));
  CONSTX #(.size(10), .\const (-4)) inst387 (.data(inst387_data));
  MP2X #(.size(4)) inst181 (.S(transparent), .X0(inst130_data), .X1(inst118_data), .Y(inst181_y));
  MP2X #(.size(4)) inst182 (.S(transparent), .X0(inst129_data), .X1(inst117_data), .Y(inst182_y));
  MP2X #(.size(4)) inst183 (.S(transparent), .X0(inst128_data), .X1(inst116_data), .Y(inst183_y));
  CONSTX #(.size(10), .\const (-2)) inst363 (.data(inst363_data));
  CMPX #(.size(10)) inst366 (.A(ya), .B(inst373_f), .ls(inst366_ls), .eq(inst366_eq));  // open: gr
  and inst370 (roze5, inst367_out, inst368_out, 1'b1, inst369_eq);
  ADD10 inst385 (.a(botax), .b(inst387_data), .f(inst385_f));
  CMPX #(.size(10)) inst378 (.A(ya), .B(inst385_f), .ls(inst378_ls), .eq(inst378_eq));  // open: gr
  or inst379 (inst379_out, inst378_ls, inst378_eq);
  and inst382 (roze6, inst379_out, inst380_out, 1'b1, inst381_eq);
  or inst19 (inst19_out, A, D);
  CONSTX #(.size(10), .\const (0)) inst328 (.data(inst328_data));
  CONSTX #(.size(10), .\const (-1)) inst345 (.data(inst345_data));
  CONSTX #(.size(10), .\const (-1)) inst351 (.data(inst351_data));
  and inst346 (roze3, inst338_out, inst339_out, 1'b1, inst343_eq);
  ADD10 inst361 (.a(botax), .b(inst363_data), .f(inst361_f));
  CMPX #(.size(10)) inst354 (.A(ya), .B(inst361_f), .ls(inst354_ls), .eq(inst354_eq));  // open: gr
  or inst355 (inst355_out, inst354_ls, inst354_eq);
  and inst358 (roze4, inst355_out, inst356_out, 1'b1, inst357_eq);
  ADD10 inst373 (.a(botax), .b(inst375_data), .f(inst373_f));
  or inst367 (inst367_out, inst366_ls, inst366_eq);
  CMPX #(.size(10)) inst310 (.A(ya), .B(inst326_f), .ls(inst310_ls), .eq(inst310_eq));  // open: gr
  and inst319 (roze1, inst311_out, inst315_out, inst318_out, inst322_out);
  ADD10 inst341 (.a(botax), .b(inst345_data), .f(inst341_f));
  CMPX #(.size(10)) inst330 (.A(ya), .B(inst341_f), .ls(inst330_ls), .eq(inst330_eq));  // open: gr
  or inst331 (inst331_out, inst330_ls, inst330_eq);
  and inst336 (roze2, inst331_out, inst332_out, 1'b1, inst333_eq);
  ADD10 inst349 (.a(botax), .b(inst351_data), .f(inst349_f));
  CMPX #(.size(10)) inst335 (.A(ya), .B(inst349_f), .ls(inst335_ls), .eq(inst335_eq));  // open: gr
  or inst338 (inst338_out, inst335_ls, inst335_eq);
  and inst20 (pink, inst34_out, inst19_out);
  ADD10 inst326 (.a(botax), .b(inst328_data), .f(inst326_f));
  or inst311 (inst311_out, inst310_ls, inst310_eq);
  CONSTX #(.size(4), .\const (15)) inst136 (.data(inst136_data));
  CONSTX #(.size(4), .\const (15)) inst135 (.data(inst135_data));
  CONSTX #(.size(4), .\const (15)) inst134 (.data(inst134_data));
  or inst284 (black, blek1, blek2, blek3, blek4, blek5, 1'b0, 1'b0, 1'b0);
  CONSTX #(.size(10), .\const (-3)) inst121 (.data(inst121_data));
  CONSTX #(.size(10), .\const (-4)) inst140 (.data(inst140_data));
  MP2X #(.size(4)) inst131 (.S(white), .X0(inst181_y), .X1(inst136_data), .Y(inst131_y));
  MP2X #(.size(4)) inst132 (.S(white), .X0(inst182_y), .X1(inst135_data), .Y(inst132_y));
  MP2X #(.size(4)) inst133 (.S(white), .X0(inst183_y), .X1(inst134_data), .Y(inst133_y));
  ADD10 inst120 (.a(leftax), .b(inst121_data), .f(inst120_f));
  CONSTX #(.size(10), .\const (-5)) inst149 (.data(inst149_data));
  CMPX #(.size(10)) inst187 (.A(xa), .B(inst120_f), .eq(inst187_eq), .gr(inst187_gr));  // open: ls
  ADD10 inst138 (.a(leftax), .b(inst140_data), .f(inst138_f));
  CMPX #(.size(10)) inst197 (.A(xa), .B(inst138_f), .eq(inst197_eq), .gr(inst197_gr));  // open: ls
  CONSTX #(.size(4), .\const (13)) inst251 (.data(inst251_data));
  or inst192 (inst192_out, inst187_eq, inst187_gr);
  or inst200 (inst200_out, inst197_eq, inst197_gr);
  ADD10 inst145 (.a(leftax), .b(inst149_data), .f(inst145_f));
  CMPX #(.size(10)) inst201 (.A(xa), .B(inst145_f), .eq(inst201_eq), .gr(inst201_gr));  // open: ls
  CONSTX #(.size(10), .\const (1)) inst155 (.data(inst155_data));
  CONSTX #(.size(10), .\const ("+4")) inst161 (.data(inst161_data));
  CONSTX #(.size(4), .\const (6)) inst253 (.data(inst253_data));
  CONSTX #(.size(4), .\const (5)) inst252 (.data(inst252_data));
  or inst204 (inst204_out, inst201_eq, inst201_gr);
  ADD10 inst151 (.a(leftax), .b(inst155_data), .f(inst151_f));
  CMPX #(.size(10)) inst205 (.A(xa), .B(inst151_f), .eq(inst205_eq), .gr(inst205_gr));  // open: ls
  ADD10 inst157 (.a(rightax), .b(inst161_data), .f(inst157_f));
  CMPX #(.size(10)) inst209 (.A(xa), .B(inst157_f), .eq(inst209_eq), .gr(inst209_gr));  // open: ls
  MP2X #(.size(4)) inst248 (.S(shade), .X0(inst131_y), .X1(inst253_data), .Y(inst248_y));
  MP2X #(.size(4)) inst249 (.S(shade), .X0(inst132_y), .X1(inst252_data), .Y(inst249_y));
  MP2X #(.size(4)) inst250 (.S(shade), .X0(inst133_y), .X1(inst251_data), .Y(inst250_y));
  CONSTX #(.size(10), .\const ("+3")) inst123 (.data(inst123_data));
  CONSTX #(.size(10), .\const (-5)) inst170 (.data(inst170_data));
  CONSTX #(.size(10), .\const ("+4")) inst141 (.data(inst141_data));
  or inst208 (inst208_out, inst205_eq, inst205_gr);
  or inst212 (inst212_out, inst209_eq, inst209_gr);
  ADD10 inst166 (.a(leftax), .b(inst170_data), .f(inst166_f));
  CMPX #(.size(10)) inst217 (.A(xa), .B(inst166_f), .eq(inst217_eq), .gr(inst217_gr));  // open: ls
  or inst165 (white, w1, w2, w3, w4, w5, w6, 1'b0, 1'b0);
  ADD10 inst122 (.a(rightax), .b(inst123_data), .f(inst122_f));
  CMPX #(.size(10)) inst188 (.A(xa), .B(inst122_f), .ls(inst188_ls), .eq(inst188_eq));  // open: gr
  ADD10 inst139 (.a(rightax), .b(inst141_data), .f(inst139_f));
  CMPX #(.size(10)) inst198 (.A(xa), .B(inst139_f), .ls(inst198_ls), .eq(inst198_eq));  // open: gr
  CONSTX #(.size(10), .\const (-1)) inst150 (.data(inst150_data));
  or inst220 (inst220_out, inst217_eq, inst217_gr);
  or inst190 (inst190_out, inst188_ls, inst188_eq);
  or inst199 (inst199_out, inst198_ls, inst198_eq);
  ADD10 inst146 (.a(rightax), .b(inst150_data), .f(inst146_f));
  CMPX #(.size(10)) inst202 (.A(xa), .B(inst146_f), .ls(inst202_ls), .eq(inst202_eq));  // open: gr
  CONSTX #(.size(10), .\const (5)) inst156 (.data(inst156_data));
  CONSTX #(.size(10), .\const ("+5")) inst162 (.data(inst162_data));
  CONSTX #(.size(4), .\const (0)) inst257 (.data(inst257_data));
  CONSTX #(.size(4), .\const (0)) inst260 (.data(inst260_data));
  or inst203 (inst203_out, inst202_ls, inst202_eq);
  ADD10 inst152 (.a(rightax), .b(inst156_data), .f(inst152_f));
  ADD10 inst158 (.a(rightax), .b(inst162_data), .f(inst158_f));
  CONSTX #(.size(4), .\const (0)) inst258 (.data(inst258_data));
  CONSTX #(.size(10), .\const (-3)) inst125 (.data(inst125_data));
  CMPX #(.size(10)) inst206 (.A(xa), .B(inst152_f), .ls(inst206_ls), .eq(inst206_eq));  // open: gr
  or inst207 (inst207_out, inst206_ls, inst206_eq);
  CMPX #(.size(10)) inst210 (.A(xa), .B(inst158_f), .ls(inst210_ls), .eq(inst210_eq));  // open: gr
  or inst211 (inst211_out, inst210_ls, inst210_eq);
  CONSTX #(.size(10), .\const (-4)) inst171 (.data(inst171_data));
  MP2X #(.size(4)) inst254 (.S(black), .X0(inst248_y), .X1(inst257_data), .Y(R));
  MP2X #(.size(4)) inst255 (.S(black), .X0(inst249_y), .X1(inst258_data), .Y(G));
  MP2X #(.size(4)) inst256 (.S(black), .X0(inst250_y), .X1(inst260_data), .Y(B));
  CMPX #(.size(10)) inst185 (.A(ya), .B(inst124_f), .eq(inst185_eq), .gr(inst185_gr));  // open: ls
  CONSTX #(.size(10), .\const ("+13")) inst144 (.data(inst144_data));
  ADD10 inst167 (.a(leftax), .b(inst171_data), .f(inst167_f));
  CMPX #(.size(10)) inst218 (.A(xa), .B(inst167_f), .ls(inst218_ls), .eq(inst218_eq));  // open: gr
  ADD10 inst124 (.a(topax), .b(inst125_data), .f(inst124_f));
  or inst191 (inst191_out, inst185_eq, inst185_gr);
  ADD10 inst142 (.a(topax), .b(inst144_data), .f(inst142_f));
  CMPX #(.size(10)) inst193 (.A(ya), .B(inst142_f), .eq(inst193_eq), .gr(inst193_gr));  // open: ls
  CONSTX #(.size(10), .\const ("+12")) inst148 (.data(inst148_data));
  or inst219 (inst219_out, inst218_ls, inst218_eq);
  or inst184 (igrac_valid, white, basetelo, transparent, shade, pink, 1'b0, 1'b0, 1'b0);
  ADD10 inst147 (.a(topax), .b(inst148_data), .f(inst147_f));
  CMPX #(.size(10)) inst194 (.A(ya), .B(inst147_f), .eq(inst194_eq), .gr(inst194_gr));  // open: ls
  CONSTX #(.size(10), .\const ("+12")) inst154 (.data(inst154_data));
  CONSTX #(.size(10), .\const (0)) inst160 (.data(inst160_data));
  CMPX #(.size(10)) inst195 (.A(ya), .B(inst153_f), .eq(inst195_eq), .gr(inst195_gr));  // open: ls
  CMPX #(.size(10)) inst196 (.A(ya), .B(inst159_f), .eq(inst196_eq), .gr(inst196_gr));  // open: ls
  ADD10 inst153 (.a(topax), .b(inst154_data), .f(inst153_f));
  ADD10 inst159 (.a(topax), .b(inst160_data), .f(inst159_f));
  or inst215 (inst215_out, inst196_eq, inst196_gr);
  CONSTX #(.size(10), .\const (0)) inst172 (.data(inst172_data));
  CONSTX #(.size(10), .\const (-1)) inst127 (.data(inst127_data));
  ADD10 inst168 (.a(topax), .b(inst172_data), .f(inst168_f));
  CMPX #(.size(10)) inst216 (.A(ya), .B(inst168_f), .eq(inst216_eq), .gr(inst216_gr));  // open: ls
  ADD10 inst126 (.a(topax), .b(inst127_data), .f(inst126_f));
  CMPX #(.size(10)) inst186 (.A(ya), .B(inst126_f), .ls(inst186_ls), .eq(inst186_eq));  // open: gr
  or inst189 (inst189_out, inst186_ls, inst186_eq);
  and inst33 (w1, inst189_out, inst191_out, inst190_out, inst192_out);
  and inst111 (w2, 1'b1, inst193_eq, inst199_out, inst200_out);
  or inst223 (inst223_out, inst216_eq, inst216_gr);
  and inst112 (w3, 1'b1, inst194_eq, inst203_out, inst204_out);
  and inst113 (w4, 1'b1, inst195_eq, inst207_out, inst208_out);
  CONSTX #(.size(10), .\const (12)) inst164 (.data(inst164_data));
  and inst114 (w5, inst214_out, inst215_out, inst211_out, inst212_out);
  ADD10 inst163 (.a(topax), .b(inst164_data), .f(inst163_f));
  CMPX #(.size(10)) inst213 (.A(ya), .B(inst163_f), .ls(inst213_ls), .eq(inst213_eq));  // open: gr
  or inst214 (inst214_out, inst213_ls, inst213_eq);
  CONSTX #(.size(10), .\const (12)) inst173 (.data(inst173_data));
  CMPX #(.size(10)) inst221 (.A(ya), .B(inst169_f), .ls(inst221_ls), .eq(inst221_eq));  // open: gr
  and inst115 (w6, inst222_out, inst223_out, inst219_out, inst220_out);
  ADD10 inst169 (.a(topax), .b(inst173_data), .f(inst169_f));
  or inst222 (inst222_out, inst221_ls, inst221_eq);
  CONSTX #(.size(10), .\const (-3)) inst174 (.data(inst174_data));
  CONSTX #(.size(10), .\const (0)) inst246 (.data(inst246_data));
  ADD10 inst137 (.a(leftax), .b(inst174_data), .f(inst137_f));
  CMPX #(.size(10)) inst228 (.A(xa), .B(inst137_f), .eq(inst228_eq), .gr(inst228_gr));  // open: ls
  ADD10 inst239 (.a(leftax), .b(inst246_data), .f(inst239_f));
  CONSTX #(.size(10), .\const (4)) inst274 (.data(inst274_data));
  or inst231 (inst231_out, inst228_eq, inst228_gr);
  CMPX #(.size(10)) inst236 (.A(xa), .B(inst239_f), .eq(inst236_eq), .gr(inst236_gr));  // open: ls
  ADD10 inst268 (.a(leftax), .b(inst274_data), .f(inst268_f));
  CMPX #(.size(10)) inst264 (.A(xa), .B(inst268_f), .eq(inst264_eq), .gr(inst264_gr));  // open: ls
  or inst241 (inst241_out, inst236_eq, inst236_gr);
  CONSTX #(.size(10), .\const (3)) inst175 (.data(inst175_data));
  CONSTX #(.size(10), .\const (0)) inst247 (.data(inst247_data));
  CONSTX #(.size(10), .\const (6)) inst283 (.data(inst283_data));
  ADD10 inst143 (.a(rightax), .b(inst175_data), .f(inst143_f));
  CMPX #(.size(10)) inst229 (.A(xa), .B(inst143_f), .ls(inst229_ls), .eq(inst229_eq));  // open: gr
  ADD10 inst278 (.a(leftax), .b(inst283_data), .f(inst278_f));
  or inst230 (inst230_out, inst229_ls, inst229_eq);
  ADD10 inst240 (.a(rightax), .b(inst247_data), .f(inst240_f));
  CMPX #(.size(10)) inst237 (.A(xa), .B(inst240_f), .ls(inst237_ls), .eq(inst237_eq));  // open: gr
  CMPX #(.size(10)) inst275 (.A(xa), .B(inst278_f), .eq(inst275_eq), .gr(inst275_gr));  // open: ls
  CONSTX #(.size(10), .\const (9)) inst299 (.data(inst299_data));
  or inst238 (inst238_out, inst237_ls, inst237_eq);
  ADD10 inst296 (.a(leftax), .b(inst299_data), .f(inst296_f));
  CONSTX #(.size(10), .\const (1)) inst295 (.data(inst295_data));
  CMPX #(.size(10)) inst292 (.A(xa), .B(inst296_f), .eq(inst292_eq), .gr(inst292_gr));  // open: ls
  CONSTX #(.size(10), .\const (2)) inst312 (.data(inst312_data));
  CONSTX #(.size(10), .\const (0)) inst177 (.data(inst177_data));
  CONSTX #(.size(10), .\const (0)) inst245 (.data(inst245_data));
  ADD10 inst290 (.a(leftax), .b(inst295_data), .f(inst290_f));
  CMPX #(.size(10)) inst288 (.A(xa), .B(inst290_f), .eq(inst288_eq), .gr(inst288_gr));  // open: ls
  ADD10 inst306 (.a(leftax), .b(inst312_data), .f(inst306_f));
  CMPX #(.size(10)) inst302 (.A(xa), .B(inst306_f), .eq(inst302_eq), .gr(inst302_gr));  // open: ls
  ADD10 inst179 (.a(topax), .b(inst177_data), .f(inst179_f));
  CMPX #(.size(10)) inst224 (.A(ya), .B(inst179_f), .eq(inst224_eq), .gr(inst224_gr));  // open: ls
  CMPX #(.size(10)) inst232 (.A(ya), .B(inst244_f), .eq(inst232_eq), .gr(inst232_gr));  // open: ls
  CONSTX #(.size(10), .\const (2)) inst273 (.data(inst273_data));
  or inst308 (inst308_out, inst302_eq, inst302_gr);
  or inst227 (inst227_out, inst224_eq, inst224_gr);
  ADD10 inst244 (.a(topax), .b(inst245_data), .f(inst244_f));
  or inst235 (inst235_out, inst232_eq, inst232_gr);
  ADD10 inst272 (.a(topax), .b(inst273_data), .f(inst272_f));
  CMPX #(.size(10)) inst259 (.A(ya), .B(inst272_f), .eq(inst259_eq), .gr(inst259_gr));  // open: ls
  or inst263 (inst263_out, inst259_eq, inst259_gr);
  CONSTX #(.size(10), .\const (-2)) inst313 (.data(inst313_data));
  CONSTX #(.size(10), .\const (11)) inst178 (.data(inst178_data));
  ADD10 inst307 (.a(rightax), .b(inst313_data), .f(inst307_f));
  ADD10 inst176 (.a(topax), .b(inst178_data), .f(inst176_f));
  CMPX #(.size(10)) inst225 (.A(ya), .B(inst176_f), .ls(inst225_ls), .eq(inst225_eq));  // open: gr
  and inst119 (transparent, inst226_out, inst227_out, inst230_out, inst231_out);
  CONSTX #(.size(10), .\const (10)) inst243 (.data(inst243_data));
  CONSTX #(.size(10), .\const (5)) inst276 (.data(inst276_data));
  CONSTX #(.size(10), .\const (2)) inst281 (.data(inst281_data));
  CMPX #(.size(10)) inst265 (.A(ya), .B(inst280_f), .eq(inst265_eq), .gr(inst265_gr));  // open: ls
  CMPX #(.size(10)) inst303 (.A(xa), .B(inst307_f), .ls(inst303_ls), .eq(inst303_eq));  // open: gr
  or inst304 (inst304_out, inst303_ls, inst303_eq);
  or inst226 (inst226_out, inst225_ls, inst225_eq);
  ADD10 inst242 (.a(topax), .b(inst243_data), .f(inst242_f));
  CMPX #(.size(10)) inst233 (.A(ya), .B(inst242_f), .ls(inst233_ls), .eq(inst233_eq));  // open: gr
  or inst234 (inst234_out, inst233_ls, inst233_eq);
  and inst180 (shade, inst234_out, inst235_out, inst238_out, inst241_out);
  CMPX #(.size(10)) inst261 (.A(ya), .B(inst271_f), .ls(inst261_ls), .eq(inst261_eq));  // open: gr
  and inst267 (blek1, inst262_out, inst263_out, 1'b1, inst264_eq);
  ADD10 inst280 (.a(topax), .b(inst281_data), .f(inst280_f));
  ADD10 inst271 (.a(topax), .b(inst276_data), .f(inst271_f));
  or inst262 (inst262_out, inst261_ls, inst261_eq);
  or inst270 (inst270_out, inst265_eq, inst265_gr);
  CONSTX #(.size(10), .\const (-15)) inst9 (.data(inst9_data));
  CONSTX #(.size(10), .\const (20)) inst10 (.data(inst10_data));
  CONSTX #(.size(10), .\const (5)) inst7 (.data(inst7_data));
  CONSTX #(.size(10), .\const (-5)) inst8 (.data(inst8_data));
  ADD10 inst6 (.a(inst10_data), .b(poz2), .f(botax));
  CONSTX #(.size(10), .\const (5)) inst282 (.data(inst282_data));
  not inst18 (notd, D);
  ADD10 inst3 (.a(inst7_data), .b(poz1), .f(rightax));
  ADD10 inst4 (.a(inst8_data), .b(poz1), .f(leftax));
  ADD10 inst5 (.a(inst9_data), .b(poz2), .f(topax));
  ADD10 inst279 (.a(topax), .b(inst282_data), .f(inst279_f));
  CMPX #(.size(10)) inst266 (.A(ya), .B(inst279_f), .ls(inst266_ls), .eq(inst266_eq));  // open: gr
  or inst269 (inst269_out, inst266_ls, inst266_eq);
  and inst277 (blek2, inst269_out, inst270_out, 1'b1, inst275_eq);
  CLK_DIVIDER #(.period_InMHz(50), .period_OutMiliSec(5)) inst12 (.in_clk(CLK), .out_clk(inst12_out_clk));
  and inst11 (levo, A, incy);
  and inst17 (desno, D, incy);
  CONSTX #(.size(10), .\const (7)) inst298 (.data(inst298_data));
  CONSTX #(.size(10), .\const (7)) inst294 (.data(inst294_data));
  ADD10 inst297 (.a(topax), .b(inst298_data), .f(inst297_f));
  CMPX #(.size(10)) inst286 (.A(ya), .B(inst297_f), .ls(inst286_ls), .eq(inst286_eq));  // open: gr
  and inst293 (blek4, inst286_eq, 1'b1, 1'b1, inst292_eq);
  CONSTX #(.size(10), .\const (8)) inst314 (.data(inst314_data));
  CMPX #(.size(10)) inst285 (.A(ya), .B(inst291_f), .ls(inst285_ls), .eq(inst285_eq));  // open: gr
  and inst289 (blek3, inst285_eq, 1'b1, 1'b1, inst288_eq);
  CMPX #(.size(10)) inst287 (.A(ya), .B(inst309_f), .ls(inst287_ls), .eq(inst287_eq));  // open: gr
  and inst305 (blek5, inst287_eq, 1'b1, inst304_out, inst308_out);
  ADD10 inst291 (.a(topax), .b(inst294_data), .f(inst291_f));
  ADD10 inst309 (.a(topax), .b(inst314_data), .f(inst309_f));
  RisingEdge inst70 (.IN(inst12_out_clk), .CLK(CLK), .OUT(clkdiv));
  CMPX #(.size(10)) inst21 (.A(rightax), .B(xa), .eq(inst21_eq), .gr(inst21_gr));  // open: ls
  CMPX #(.size(10)) inst22 (.A(leftax), .B(xa), .ls(inst22_ls), .eq(inst22_eq));  // open: gr
  CMPX #(.size(10)) inst23 (.A(topax), .B(ya), .ls(inst23_ls), .eq(inst23_eq));  // open: gr
  or inst27 (inst27_out, inst23_eq, inst23_ls);
  or inst25 (inst25_out, inst21_gr, inst21_eq);
  or inst26 (inst26_out, inst22_eq, inst22_ls);
  CMPX #(.size(10)) inst24 (.A(botax), .B(ya), .eq(inst24_eq), .gr(inst24_gr));  // open: ls
  or inst28 (inst28_out, inst24_gr, inst24_eq);
  and inst29 (inst29_out, inst25_out, inst26_out);
  and inst30 (inst30_out, inst28_out, inst27_out);
  and inst31 (basetelo, inst29_out, inst30_out);
  CONSTX #(.size(10), .\const (-3)) inst58 (.data(inst58_data));
  CONSTX #(.size(10), .\const (-3)) inst83 (.data(inst83_data));
  CONSTX #(.size(10), .\const (760)) inst420 (.data(inst420_data));
  ADD10 inst13 (.a(botax), .b(inst58_data), .f(inst13_f));
  MP2X #(.size(10)) inst421 (.S(tp11), .X0(inst43_f), .X1(inst420_data), .Y(inst421_y));
  ADD10 inst54 (.a(botax), .b(inst83_data), .f(inst54_f));
  ALUX #(.size(10)) inst43 (.B(inst110_data), .A(poz1), .op(XALU), .F(inst43_f));  // open: Cin, Cout
  REGX #(.size(10), .default_value(400)) inst (
    .clk(CLK), .ld(ldx), .data_in(inst410_y), .data_out(poz1));  // open: cl, inc, dec
  CONSTX #(.size(10), .\const (1)) inst110 (.data(inst110_data));
  CONSTX #(.size(10), .\const (40)) inst411 (.data(inst411_data));
  Layer0 inst71 (.X(leftax), .Y(topax), .podloga(topleftcol));  // open: R, G, B, superskok, teleport1, teleport2
  MP2X #(.size(10)) inst410 (.S(tp21), .X0(inst421_y), .X1(inst411_data), .Y(inst410_y));
  Layer0 inst35 (.X(rightax), .Y(topax), .podloga(toprightcol));  // open: R, G, B, superskok, teleport1, teleport2
  Layer0 inst56 (
    .X(rightax), .Y(botax), .podloga(botrightcol), .superskok(superskok1));  // open: R, G, B, teleport1, teleport2
  Layer0 inst108 (
    .X(leftax), .Y(botax), .podloga(botleftcol), .superskok(superskok2));  // open: R, G, B, teleport1, teleport2
  Layer0 inst400 (
    .X(leftax), .Y(inst13_f), .podloga(sideleftcol), .teleport1(tp11));  // open: R, G, B, superskok, teleport2
  Layer0 inst403 (
    .X(rightax), .Y(inst54_f), .podloga(siderightcol), .teleport2(tp21));  // open: R, G, B, superskok, teleport1
  CONSTX #(.size(10), .\const (555)) inst418 (.data(inst418_data));
  MP2X #(.size(10)) inst422 (.S(tp11), .X0(inst66_f), .X1(inst418_data), .Y(inst422_y));
  or inst78 (inst78_out, sideleftcol, 1'b0, topleftcol, toprightcol);
  CONSTX #(.size(10), .\const (1)) inst102 (.data(inst102_data));
  CONSTX #(.size(10), .\const (-1)) inst92 (.data(inst92_data));
  or inst81 (inst81_out, sideleftcol, 1'b0, topleftcol, toprightcol);
  not inst79 (inst79_out, inst78_out);
  MP2X #(.size(10)) inst405 (.S(leti), .X0(inst102_data), .X1(inst92_data), .Y(inst405_y));
  ALUX #(.size(10)) inst66 (.B(inst405_y), .A(poz2), .op(3'b100), .F(inst66_f));  // open: Cin, Cout
  CONSTX #(.size(10), .\const (170)) inst413 (.data(inst413_data));
  REGX #(.size(10), .default_value(500)) inst1 (
    .clk(CLK), .ld(ldy), .dec(decy), .data_in(inst412_y), .data_out(poz2));  // open: cl, inc
  or inst69 (inst69_out, botrightcol, botleftcol);
  not inst82 (inst82_out, inst81_out);
  and inst80 (inst80_out, botrightcol, inst82_out);
  and inst77 (inst77_out, botleftcol, inst79_out);
  MP2X #(.size(10)) inst412 (.S(tp21), .X0(inst422_y), .X1(inst413_data), .Y(inst412_y));
  not inst68 (inst68_out, topleftcol);
  not inst65 (inst65_out, toprightcol);
  or inst38 (inst38_out, botrightcol, botleftcol);
  or inst41 (inst41_out, topleftcol, botleftcol);
  and inst64 (inst64_out, inst65_out, 1'b1, inst38_out);
  or inst36 (inst36_out, toprightcol, botrightcol);
  and inst67 (inst67_out, inst68_out, 1'b1, inst69_out);
  not inst44 (inst44_out, inst41_out);
  or inst49 (inst49_out, botleftcol, botrightcol);
  or inst52 (inst52_out, topleftcol, toprightcol);
  and inst72 (inst72_out, D, inst80_out);
  and inst74 (inst74_out, A, inst77_out);
  not inst37 (inst37_out, inst36_out);
  not inst50 (nadole, inst49_out);
  not inst53 (nagore, inst52_out);
  and inst73 (desnodiag, inst72_out, clkdiv);
  CMPX #(.size(10)) inst40 (.A(inst405_y), .B(inst55_data), .ls(nepozitivnovy), .gr(pozitivnovy));  // open: eq
  or inst42 (inst42_out, inst67_out, inst44_out);
  and inst75 (levodiag, inst74_out, clkdiv);
  CONSTX #(.size(10), .\const (75)) inst60 (.data(inst60_data));
  CONSTX #(.size(10), .\const (500)) inst404 (.data(inst404_data));
  or inst407 (superskokx, superskok1, superskok2);
  CONSTX #(.size(10), .\const (0)) inst55 (.data(inst55_data));
  or inst2 (inst2_out, inst64_out, 1'b0, inst37_out);
  and inst45 (inst45_out, A, inst42_out);
  and inst96 (inst96_out, sideleftcol, botleftcol);
  not inst97 (inst97_out, inst96_out);
  MP2X #(.size(10)) inst406 (.S(superskokx), .X0(inst60_data), .X1(inst404_data), .Y(inst406_y));
  not inst51 (inst51_out, nagore);
  and inst99 (inst99_out, siderightcol, botrightcol);
  and inst93 (inst93_out, D, inst2_out);
  and inst95 (inst95_out, inst45_out, inst97_out);
  and inst84 (inst84_out, pozitivnovy, nadole);
  and inst85 (inst85_out, nepozitivnovy, nagore);
  and inst88 (incvy, nepozitivnovy, clkdiv);
  not inst100 (inst100_out, inst99_out);
  REGX #(.size(10), .default_value(0)) inst59 (
    .clk(CLK), .ld(ldskok), .cl(inst51_out), .dec(inst89_out), .data_in(inst406_y), .data_out(inst59_data_out));  // open: inc
  and inst94 (inst94_out, inst100_out, inst93_out);
  CONSTX #(.size(10), .\const (0)) inst76 (.data(inst76_data));
  CMPX #(.size(10)) inst61 (.A(inst59_data_out), .B(inst76_data), .gr(leti));  // open: ls, eq
  or inst86 (inst86_out, inst84_out, inst85_out);
  and inst39 (addx, inst94_out, clkdiv);
  or inst57 (inst57_out, levodiag, 1'b0, desnodiag);
  and inst87 (inst87_out, inst86_out, clkdiv);
  and inst46 (subx, inst95_out, clkdiv);
  and inst89 (inst89_out, clkdiv, leti);
  or inst416 (inst416_out, tp21, tp11);
  and inst98 (inst98_out, W, nagore);
  or inst417 (ldy, inst87_out, inst416_out);
  or inst48 (inst48_out, addx, subx);
  MP2X #(.size(3)) inst47 (.S(subx), .X0(3'b100), .X1(3'b101), .Y(XALU));
  or inst106 (setdoublejump, toprightcol, botleftcol, topleftcol, botrightcol);
  or inst414 (inst414_out, tp21, tp11);
  or inst101 (decy, inst57_out, inst98_out);
  and inst103 (inst103_out, doublejump, W);
  or inst415 (ldx, inst48_out, inst414_out);
  not inst109 (inst109_out, setdoublejump);
  JKFF inst409 (.K(cldoublejump), .J(setdoublejump), .CLK(CLK), .Q(doublejump));  // open: PRN, CLRN
  and inst104 (cldoublejump, inst103_out, inst109_out);
  and inst107 (inst107_out, setdoublejump, W);
  or inst105 (inst105_out, cldoublejump, inst107_out);
  or inst408 (ldskok, inst105_out, superskokx);

  // Other names for the same wires on the sheet: skok = W; x[9:0] = poz1; y[9:0] = poz2

  // Notes on the sheet:
  //   Usporavamo clock, kako bi mogli da izmerimo
  //   odredjeni vremenski interval
  //   Spojem CLK_DIVIDER-a i RISING_EDGE strukture
  //   dobija se tajmer koji pozitivnim impulsom 
  //   obavestava o proteklom vremenu
endmodule
